# EAGLE schematic SLB_EXT_EAGLE (EAGLE 9.6.2), part 1 of 2

## Sheet 1 of 14
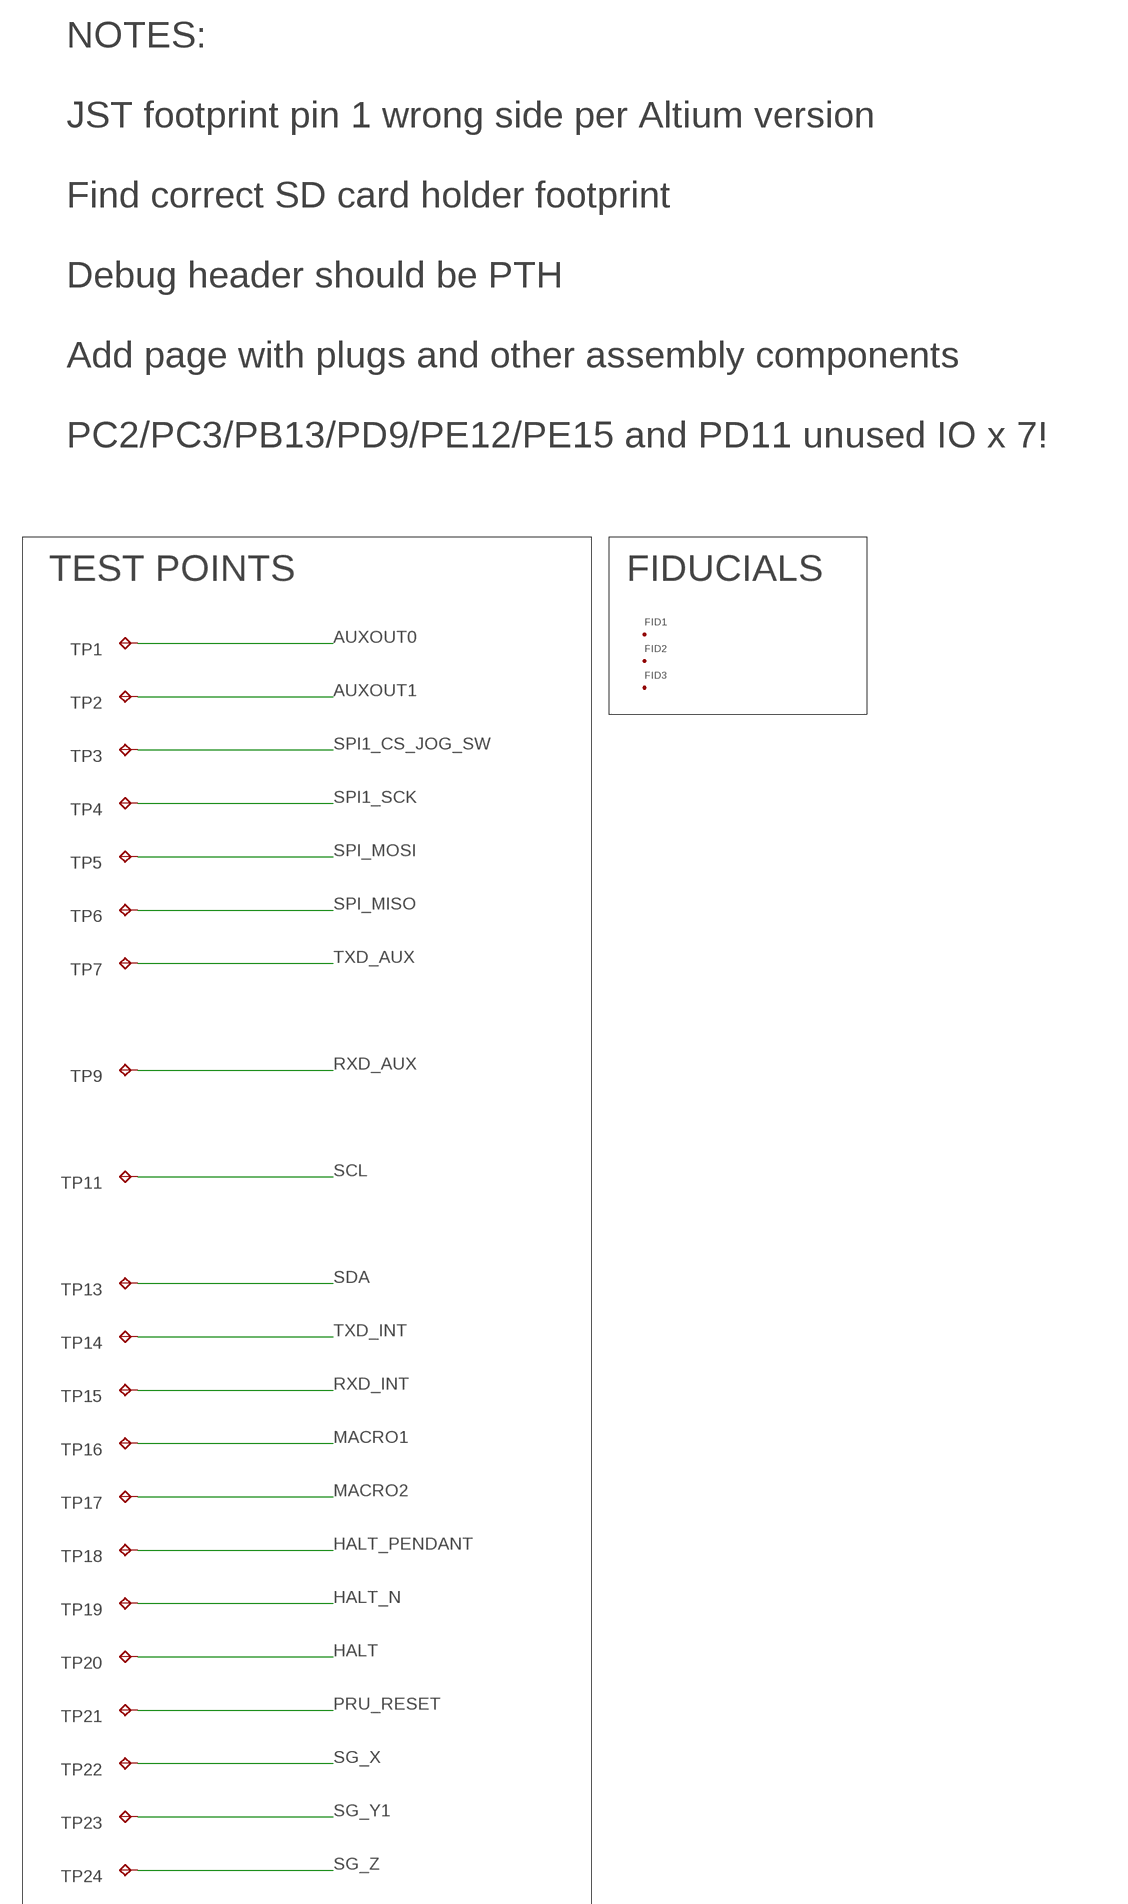
[diagram p0: schematic, sheet 1, part 1 of 2]
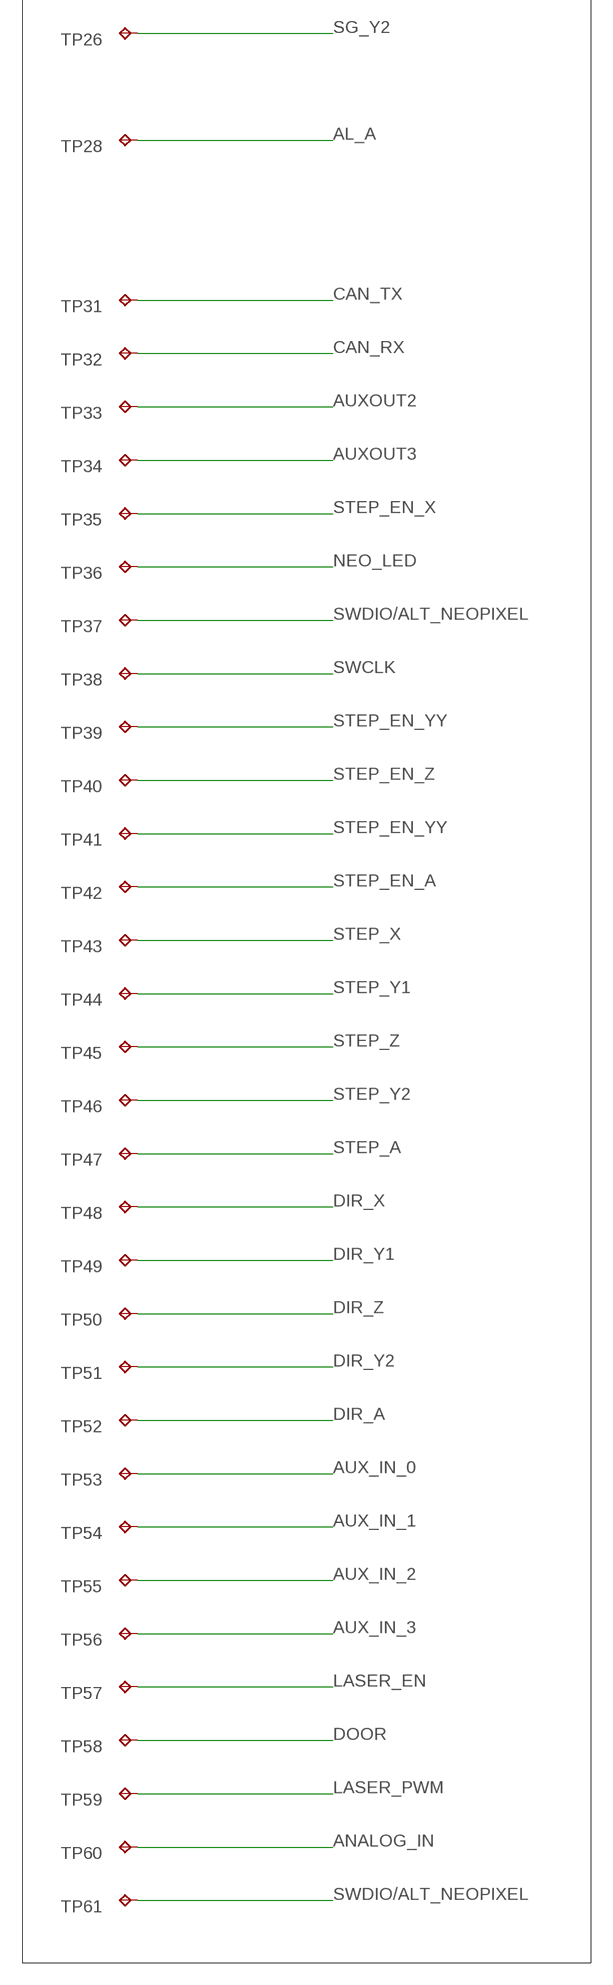
[diagram p1: schematic, sheet 1, part 2 of 2]

### Parts
FID1  FID_40MIL_P  [FID_040_P]
FID2  FID_40MIL_P  [FID_040_P]
FID3  FID_40MIL_P  [FID_040_P]
TP1  TPB2,54  [B2,54]
TP2  TPB2,54  [B2,54]
TP3  TPB2,54  [B2,54]
TP4  TPB2,54  [B2,54]
TP5  TPB2,54  [B2,54]
TP6  TPB2,54  [B2,54]
TP7  TPB2,54  [B2,54]
TP9  TPB2,54  [B2,54]
TP11  TPB2,54  [B2,54]
TP13  TPB2,54  [B2,54]
TP14  TPB2,54  [B2,54]
TP15  TPB2,54  [B2,54]
TP16  TPB2,54  [B2,54]
TP17  TPB2,54  [B2,54]
TP18  TPB2,54  [B2,54]
TP19  TPB2,54  [B2,54]
TP20  TPB2,54  [B2,54]
TP21  TPB2,54  [B2,54]
TP22  TPB2,54  [B2,54]
TP23  TPB2,54  [B2,54]
TP24  TPB2,54  [B2,54]
TP26  TPB2,54  [B2,54]
TP28  TPB2,54  [B2,54]
TP31  TPB2,54  [B2,54]
TP32  TPB2,54  [B2,54]
TP33  TPB2,54  [B2,54]
TP34  TPB2,54  [B2,54]
TP35  TPB2,54  [B2,54]
TP36  TPB2,54  [B2,54]
TP37  TPB2,54  [B2,54]
TP38  TPB2,54  [B2,54]
TP39  TPB2,54  [B2,54]
TP40  TPB2,54  [B2,54]
TP41  TPB2,54  [B2,54]
TP42  TPB2,54  [B2,54]
TP43  TPB2,54  [B2,54]
TP44  TPB2,54  [B2,54]
TP45  TPB2,54  [B2,54]
TP46  TPB2,54  [B2,54]
TP47  TPB2,54  [B2,54]
TP48  TPB2,54  [B2,54]
TP49  TPB2,54  [B2,54]
TP50  TPB2,54  [B2,54]
TP51  TPB2,54  [B2,54]
TP52  TPB2,54  [B2,54]
TP53  TPB2,54  [B2,54]
TP54  TPB2,54  [B2,54]
TP55  TPB2,54  [B2,54]
TP56  TPB2,54  [B2,54]
TP57  TPB2,54  [B2,54]
TP58  TPB2,54  [B2,54]
TP59  TPB2,54  [B2,54]
TP60  TPB2,54  [B2,54]
TP61  TPB2,54  [B2,54]

### Nets
AL_A: TP28.TP ; also sheet 3,6
ANALOG_IN: TP60.TP ; also sheet 3,6
AUX_IN_0: TP53.TP ; also sheet 3,6
AUX_IN_1: TP54.TP ; also sheet 3,6
AUX_IN_2: TP55.TP ; also sheet 3,6
AUX_IN_3: TP56.TP ; also sheet 3,6
AUXOUT0: TP1.TP ; also sheet 3,6
AUXOUT1: TP2.TP ; also sheet 3,6
AUXOUT2: TP33.TP ; also sheet 3,6
AUXOUT3: TP34.TP ; also sheet 3,6
CAN_RX: TP32.TP ; also sheet 3,12
CAN_TX: TP31.TP ; also sheet 3,12
DIR_A: TP52.TP ; also sheet 3,6
DIR_X: TP48.TP ; also sheet 3,5
DIR_Y1: TP49.TP ; also sheet 3,5
DIR_Y2: TP51.TP ; also sheet 3,5
DIR_Z: TP50.TP ; also sheet 3,5
DOOR: TP58.TP ; also sheet 3,8
HALT: TP20.TP ; also sheet 2
HALT_N: TP19.TP ; also sheet 2,3,6,7
HALT_PENDANT: TP18.TP ; also sheet 2,12
LASER_EN: TP57.TP ; also sheet 3,11
LASER_PWM: TP59.TP ; also sheet 3,11
MACRO1: TP16.TP ; also sheet 3,7
MACRO2: TP17.TP ; also sheet 3,7
NEO_LED: TP36.TP ; also sheet 3,6
PRU_RESET: TP21.TP ; also sheet 3,4
RXD_AUX: TP9.TP ; also sheet 3,6
RXD_INT: TP15.TP ; also sheet 3
SCL: TP11.TP ; also sheet 3,6
SDA: TP13.TP ; also sheet 3,6
SG_X: TP22.TP ; also sheet 3,5
SG_Y1: TP23.TP ; also sheet 3,5
SG_Y2: TP26.TP ; also sheet 3,5
SG_Z: TP24.TP ; also sheet 3,5
SPI1_CS_JOG_SW: TP3.TP ; also sheet 3,4
SPI1_SCK: TP4.TP ; also sheet 3
SPI_MISO: TP6.TP ; also sheet 3
SPI_MOSI: TP5.TP ; also sheet 3
STEP_A: TP47.TP ; also sheet 3,6
STEP_EN_A: TP42.TP ; also sheet 3,6
STEP_EN_X: TP35.TP ; also sheet 3,5
STEP_EN_YY: TP39.TP TP41.TP ; also sheet 3,5
STEP_EN_Z: TP40.TP ; also sheet 3,5
STEP_X: TP43.TP ; also sheet 3,5
STEP_Y1: TP44.TP ; also sheet 3,5
STEP_Y2: TP46.TP ; also sheet 3,5
STEP_Z: TP45.TP ; also sheet 3,5
SWCLK: TP38.TP ; also sheet 3,4
SWDIO/ALT_NEOPIXEL: TP37.TP TP61.TP ; also sheet 3,4,6
TXD_AUX: TP7.TP ; also sheet 3,6
TXD_INT: TP14.TP ; also sheet 3

### Notes on the sheet
- NOTES:
  
  JST footprint pin 1 wrong side per Altium version
  
  Find correct SD card holder footprint
  
  Debug header should be PTH
  
  Add page with plugs and other assembly components
  
  PC2/PC3/PB13/PD9/PE12/PE15 and PD11 unused IO x 7!
- TEST POINTS | FIDUCIALS

## Sheet 2 of 14: Equiv to Page 4/27 of Longboard_32bit_ext_Schematic_B9_FULL_PLACE.PDF
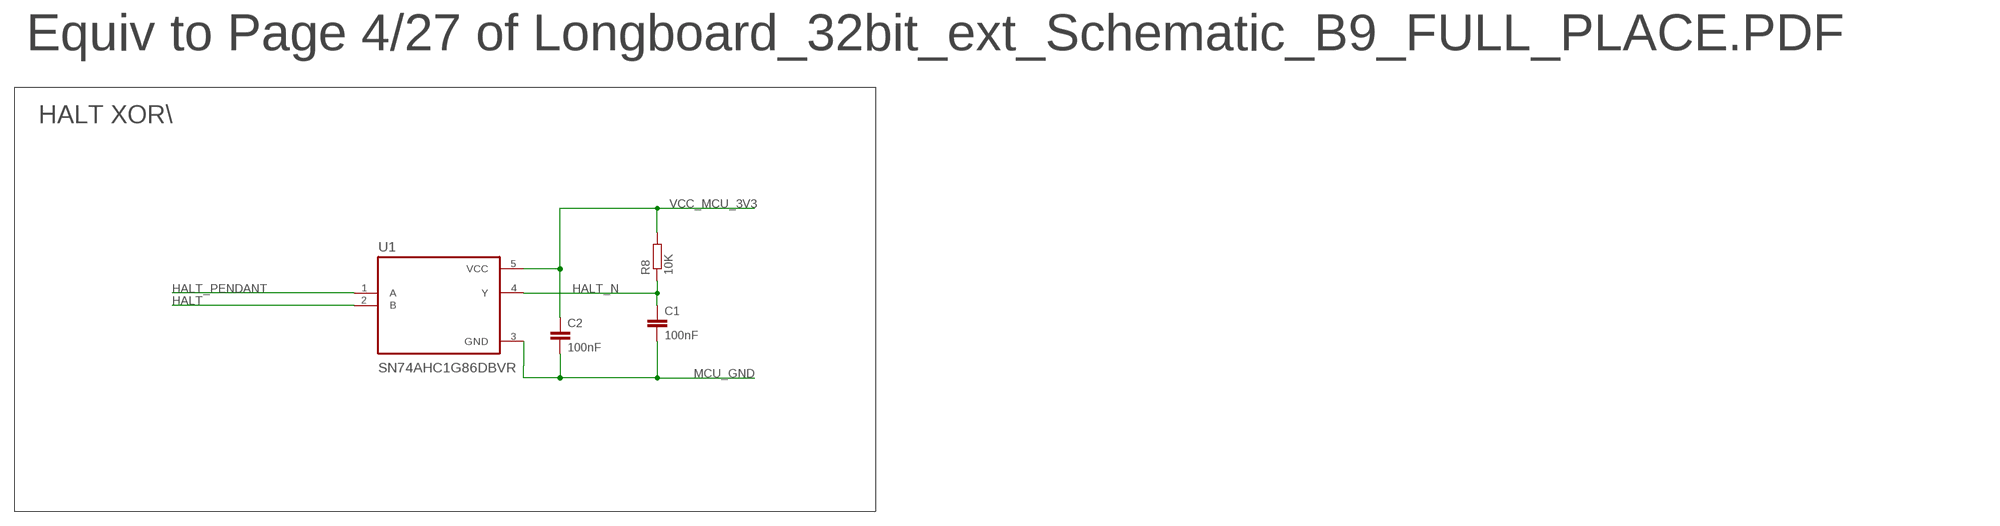
[diagram p2: schematic, sheet 2]

### Parts
C1  100nF  C-EUC0402  [C0402]
C2  100nF  C-EUC0402  [C0402]
R8  10K  R-EU_R0402  [R0402]
U1  SN74AHC1G86DBVR  [SOT95P280X145-5N]

### Nets
HALT: U1.2(B) ; also sheet 1
HALT_N: C1.1 R8.1 U1.4(Y) ; also sheet 1,3,6,7
HALT_PENDANT: U1.1(A) ; also sheet 1,12
MCU_GND: C1.2 C2.2 U1.3(GND) ; also sheet 3,5,6,9,11,12,13,14
VCC_MCU_3V3: C2.1 R8.2 U1.5(VCC) ; also sheet 3,4,5,6,7,8,9,11,12,14

### Notes on the sheet
- Equiv to Page 4/27 of Longboard_32bit_ext_Schematic_B9_FULL_PLACE.PDF
- HALT XOR\

## Sheet 3 of 14: Equiv to Page 5/27 of Longboard_32bit_ext_Schematic_B9_FULL_PLACE.PDF
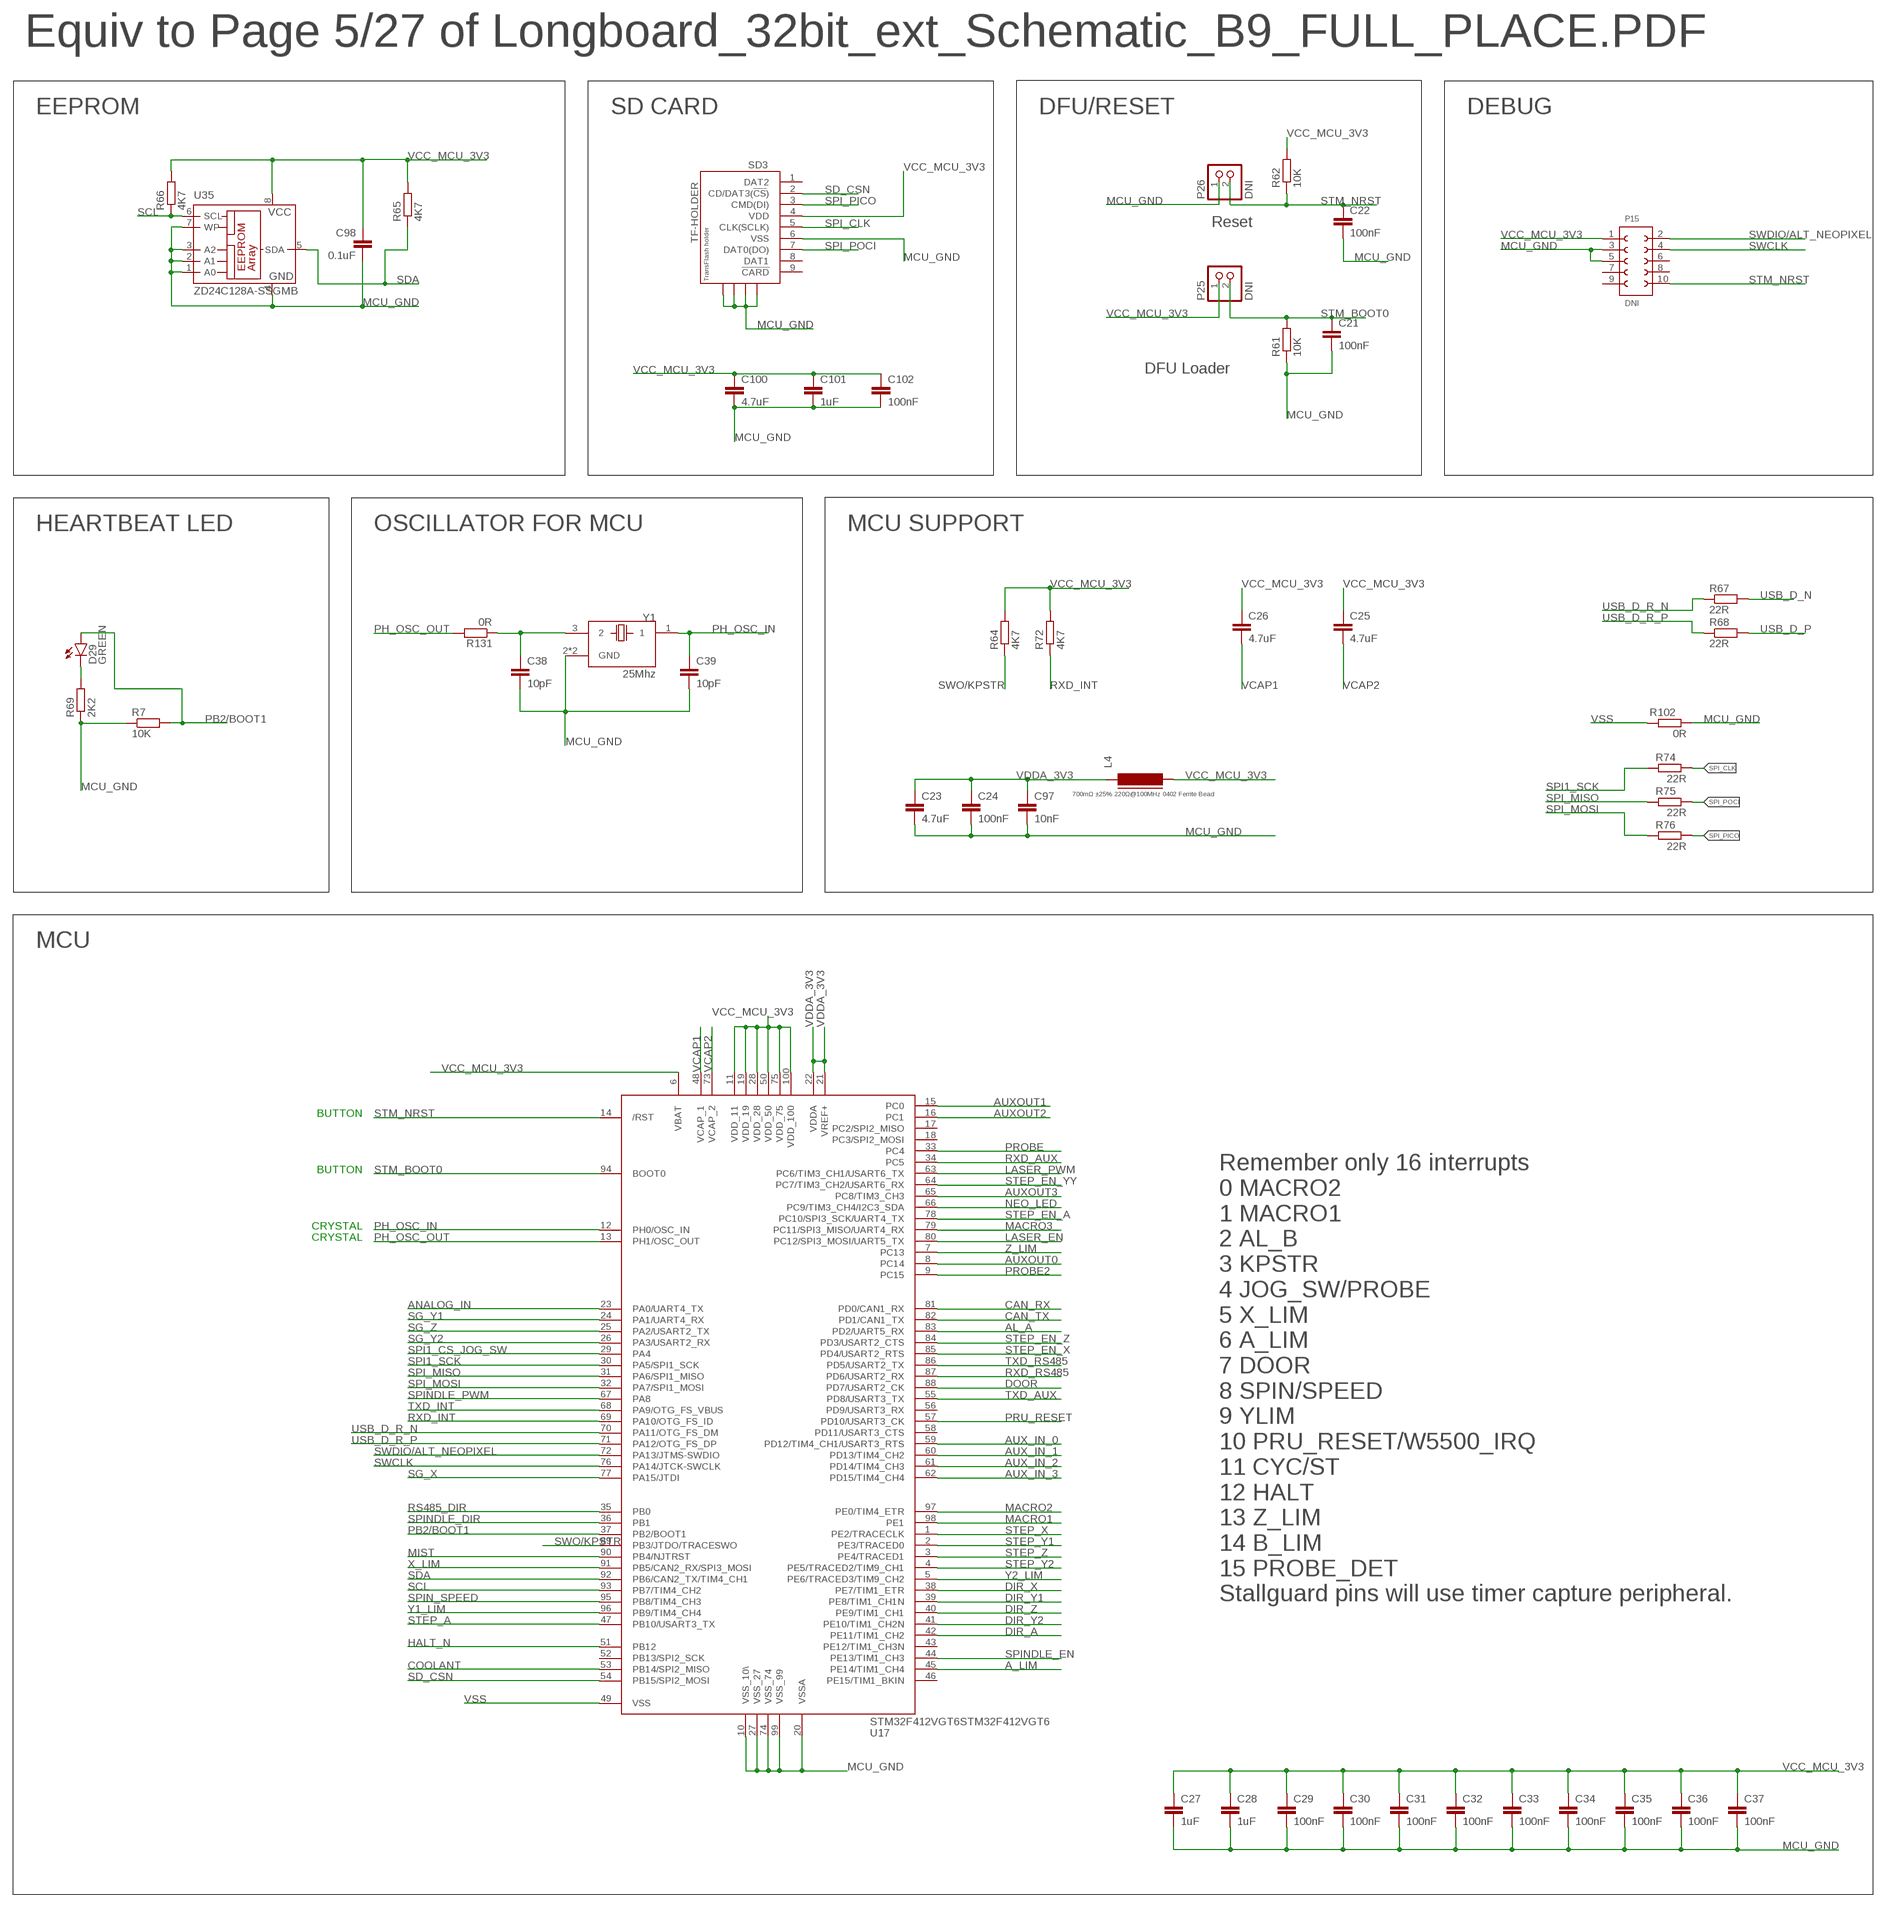
[diagram p3: schematic, sheet 3]

### Parts
C21  100nF  C-EUC0402  [C0402]
C22  100nF  C-EUC0402  [C0402]
C23  4.7uF  C-EUC0603K  [C0603K]
C24  100nF  C-EUC0402  [C0402]
C25  4.7uF  C-EUC0603K  [C0603K]
C26  4.7uF  C-EUC0603K  [C0603K]
C27  1uF  C-EUC0603  [C0603]
C28  1uF  C-EUC0603K  [C0603K]
C29  100nF  C-EUC0402  [C0402]
C30  100nF  C-EUC0402  [C0402]
C31  100nF  C-EUC0402  [C0402]
C32  100nF  C-EUC0402  [C0402]
C33  100nF  C-EUC0402  [C0402]
C34  100nF  C-EUC0402  [C0402]
C35  100nF  C-EUC0402  [C0402]
C36  100nF  C-EUC0402  [C0402]
C37  100nF  C-EUC0402  [C0402]
C38  10pF  C-EUC0603K  [C0603K]
C39  10pF  C-EUC0603K  [C0603K]
C97  10nF  C-EUC0402  [C0402]
C98  0.1uF  CAP0805  [0805]
C100  4.7uF  C-EUC0603K  [C0603K]
C101  1uF  C-EUC0402  [C0402]
C102  100nF  C-EUC0402  [C0402]
D29  GREEN  LEDCHIP-LED0603  [CHIP-LED0603]
L4  700mΩ ±25% 220Ω@100MHz 0402 Ferrite Bead  FERRITE-0402  [FB402]
P15  DNI  621X1021021  [621X1021021]
P25  DNI  PINHD-1X2  [1X02]
P26  DNI  PINHD-1X2  [1X02]
R7  10K  R-EU_R0402  [R0402]
R61  10K  R-EU_R0402  [R0402]
R62  10K  R-EU_R0402  [R0402]
R64  4K7  R-EU_R0402  [R0402]
R65  4K7  R-EU_R0402  [R0402]
R66  4K7  R-EU_R0402  [R0402]
R67  22R  R-EU_R0603  [R0603]
R68  22R  R-EU_R0603  [R0603]
R69  2K2  R-EU_R0402  [R0402]
R72  4K7  R-EU_R0402  [R0402]
R74  22R  R-EU_R0603  [R0603]
R75  22R  R-EU_R0603  [R0603]
R76  22R  R-EU_R0603  [R0603]
R102  0R  R-EU_R0603  [R0603]
R131  0R  R-EU_R0603  [R0603]
SD3  TF-HOLDER  [TF-PULL]
U17  STM32F412VGT6STM32F412VGT6  [LQFP100]
U35  ZD24C128A-SSGMB  24C64SM  [SO-08M]
Y1  25Mhz  TSX-3225_16.0000MF18X-AC3  [XTAL_TSX-3225_16.0000MF18X-AC3]

### Nets
A_LIM: U17.45(PE14/TIM1_CH4) ; also sheet 8
AL_A: U17.83(PD2/UART5_RX) ; also sheet 1,6
ANALOG_IN: U17.23(PA0/UART4_TX) ; also sheet 1,6
AUX_IN_0: U17.59(PD12/TIM4_CH1/USART3_RTS) ; also sheet 1,6
AUX_IN_1: U17.60(PD13/TIM4_CH2) ; also sheet 1,6
AUX_IN_2: U17.61(PD14/TIM4_CH3) ; also sheet 1,6
AUX_IN_3: U17.62(PD15/TIM4_CH4) ; also sheet 1,6
AUXOUT0: U17.8(PC14) ; also sheet 1,6
AUXOUT1: U17.15(PC0) ; also sheet 1,6
AUXOUT2: U17.16(PC1) ; also sheet 1,6
AUXOUT3: U17.65(PC8/TIM3_CH3) ; also sheet 1,6
CAN_RX: U17.81(PD0/CAN1_RX) ; also sheet 1,12
CAN_TX: U17.82(PD1/CAN1_TX) ; also sheet 1,12
COOLANT: U17.53(PB14/SPI2_MISO) ; also sheet 6
DIR_A: U17.42(PE11/TIM1_CH2) ; also sheet 1,6
DIR_X: U17.38(PE7/TIM1_ETR) ; also sheet 1,5
DIR_Y1: U17.39(PE8/TIM1_CH1N) ; also sheet 1,5
DIR_Y2: U17.41(PE10/TIM1_CH2N) ; also sheet 1,5
DIR_Z: U17.40(PE9/TIM1_CH1) ; also sheet 1,5
DOOR: U17.88(PD7/USART2_CK) ; also sheet 1,8
HALT_N: U17.51(PB12) ; also sheet 1,2,6,7
LASER_EN: U17.80(PC12/SPI3_MOSI/UART5_TX) ; also sheet 1,11
LASER_PWM: U17.63(PC6/TIM3_CH1/USART6_TX) ; also sheet 1,11
MACRO1: U17.98(PE1) ; also sheet 1,7
MACRO2: U17.97(PE0/TIM4_ETR) ; also sheet 1,7
MACRO3: U17.79(PC11/SPI3_MISO/UART4_RX) ; also sheet 7
MCU_GND: C21.2 C22.2 C23.2 C24.2 C27.2 C28.2 C29.2 C30.2 C31.2 C32.2 C33.2 C34.2 C35.2 C36.2 C37.2 C38.2 C39.2 C97.2 C98.2 C100.2 C101.2 C102.2 P15.3 P15.5 P26.1 R7.1 R61.1 R69.1 R102.1 SD3.6(VSS) SD3.S1 SD3.S2 SD3.S3 SD3.S4 U17.10(VSS_10\) U17.20(VSSA) U17.27(VSS_27) U17.74(VSS_74) U17.99(VSS_99) U35.1(A0) U35.2(A1) U35.3(A2) U35.4(GND) U35.7(WP) Y1.2(GND) Y1.4(GND) ; also sheet 2,5,6,9,11,12,13,14
MIST: U17.90(PB4/NJTRST) ; also sheet 6
N$2: C38.1 R131.1 Y1.3
N$8: D29.C R69.2
NEO_LED: U17.66(PC9/TIM3_CH4/I2C3_SDA) ; also sheet 1,6
PB2/BOOT1: D29.A R7.2 U17.37(PB2/BOOT1)
PH_OSC_IN: C39.1 U17.12(PH0/OSC_IN) Y1.1
PH_OSC_OUT: R131.2 U17.13(PH1/OSC_OUT)
PROBE: U17.33(PC4) ; also sheet 8
PROBE2: U17.9(PC15) ; also sheet 8
PRU_RESET: U17.57(PD10/USART3_CK) ; also sheet 1,4
RS485_DIR: U17.35(PB0) ; also sheet 14
RXD_AUX: U17.34(PC5) ; also sheet 1,6
RXD_INT: R72.1 U17.69(PA10/OTG_FS_ID) ; also sheet 1
RXD_RS485: U17.87(PD6/USART2_RX) ; also sheet 14
SCL: R66.1 U17.93(PB7/TIM4_CH2) U35.6(SCL) ; also sheet 1,6
SD_CSN: SD3.2(CD/DAT3(!CS!)) U17.54(PB15/SPI2_MOSI)
SDA: R65.1 U17.92(PB6/CAN2_TX/TIM4_CH1) U35.5(SDA) ; also sheet 1,6
SG_X: U17.77(PA15/JTDI) ; also sheet 1,5
SG_Y1: U17.24(PA1/UART4_RX) ; also sheet 1,5
SG_Y2: U17.26(PA3/USART2_RX) ; also sheet 1,5
SG_Z: U17.25(PA2/USART2_TX) ; also sheet 1,5
SPI1_CS_JOG_SW: U17.29(PA4) ; also sheet 1,4
SPI1_SCK: R74.2 U17.30(PA5/SPI1_SCK) ; also sheet 1
SPI_CLK: R74.1 SD3.5(CLK(SCLK)) ; also sheet 4
SPI_MISO: R75.2 U17.31(PA6/SPI1_MISO) ; also sheet 1
SPI_MOSI: R76.2 U17.32(PA7/SPI1_MOSI) ; also sheet 1
SPI_PICO: R76.1 SD3.3(CMD(DI)) ; also sheet 4
SPI_POCI: R75.1 SD3.7(DAT0(DO)) ; also sheet 4
SPIN_SPEED: U17.95(PB8/TIM4_CH3) ; also sheet 11
SPINDLE_DIR: U17.36(PB1) ; also sheet 11
SPINDLE_EN: U17.44(PE13/TIM1_CH3) ; also sheet 11
SPINDLE_PWM: U17.67(PA8) ; also sheet 11
STEP_A: U17.47(PB10/USART3_TX) ; also sheet 1,6
STEP_EN_A: U17.78(PC10/SPI3_SCK/UART4_TX) ; also sheet 1,6
STEP_EN_X: U17.85(PD4/USART2_RTS) ; also sheet 1,5
STEP_EN_YY: U17.64(PC7/TIM3_CH2/USART6_RX) ; also sheet 1,5
STEP_EN_Z: U17.84(PD3/USART2_CTS) ; also sheet 1,5
STEP_X: U17.1(PE2/TRACECLK) ; also sheet 1,5
STEP_Y1: U17.2(PE3/TRACED0) ; also sheet 1,5
STEP_Y2: U17.4(PE5/TRACED2/TIM9_CH1) ; also sheet 1,5
STEP_Z: U17.3(PE4/TRACED1) ; also sheet 1,5
STM_BOOT0: C21.1 P25.2 R61.2 U17.94(BOOT0) ; also sheet 4
STM_NRST: C22.1 P15.10 P26.2 R62.1 U17.14(/RST) ; also sheet 4
SWCLK: P15.4 U17.76(PA14/JTCK-SWCLK) ; also sheet 1,4
SWDIO/ALT_NEOPIXEL: P15.2 U17.72(PA13/JTMS-SWDIO) ; also sheet 1,4,6
SWO/KPSTR: R64.1 U17.89(PB3/JTDO/TRACESWO)
TXD_AUX: U17.55(PD8/USART3_TX) ; also sheet 1,6
TXD_INT: U17.68(PA9/OTG_FS_VBUS) ; also sheet 1
TXD_RS485: U17.86(PD5/USART2_TX) ; also sheet 14
USB_D_N: R67.2 ; also sheet 13
USB_D_P: R68.2 ; also sheet 13
USB_D_R_N: R67.1 U17.70(PA11/OTG_FS_DM)
USB_D_R_P: R68.1 U17.71(PA12/OTG_FS_DP)
VCAP1: C26.2 U17.48(VCAP_1)
VCAP2: C25.2 U17.73(VCAP_2)
VCC_MCU_3V3: C25.1 C26.1 C27.1 C28.1 C29.1 C30.1 C31.1 C32.1 C33.1 C34.1 C35.1 C36.1 C37.1 C98.1 C100.1 C101.1 C102.1 L4.2 P15.1 P25.1 R62.2 R64.2 R65.2 R66.2 R72.2 SD3.4(VDD) U17.6(VBAT) U17.11(VDD_11) U17.19(VDD_19) U17.28(VDD_28) U17.50(VDD_50) U17.75(VDD_75) U17.100(VDD_100) U35.8(VCC) ; also sheet 2,4,5,6,7,8,9,11,12,14
VDDA_3V3: C23.1 C24.1 C97.1 L4.1 U17.21(VREF+) U17.22(VDDA)
VSS: R102.2 U17.49(VSS)
X_LIM: U17.91(PB5/CAN2_RX/SPI3_MOSI) ; also sheet 8
Y1_LIM: U17.96(PB9/TIM4_CH4) ; also sheet 8
Y2_LIM: U17.5(PE6/TRACED3/TIM9_CH2) ; also sheet 8
Z_LIM: U17.7(PC13) ; also sheet 8
Unconnected: P15.6 P15.7 P15.8 P15.9 SD3.1(DAT2) SD3.8(DAT1) SD3.9(!CARD) U17.17(PC2/SPI2_MISO) U17.18(PC3/SPI2_MOSI) U17.43(PE12/TIM1_CH3N) U17.46(PE15/TIM1_BKIN) U17.52(PB13/SPI2_SCK) U17.56(PD9/USART3_RX) U17.58(PD11/USART3_CTS)

### Notes on the sheet
- Equiv to Page 5/27 of Longboard_32bit_ext_Schematic_B9_FULL_PLACE.PDF
- EEPROM | SD CARD | DFU/RESET | DEBUG
- Reset
- DFU Loader
- HEARTBEAT LED | OSCILLATOR FOR MCU | MCU SUPPORT
- MCU
- BUTTON
- BUTTON
- CRYSTAL
- CRYSTAL
- Remember only 16 interrupts 
  0 MACRO2 
  1 MACRO1 
  2 AL_B 
  3 KPSTR 
  4 JOG_SW/PROBE 
  5 X_LIM 
  6 A_LIM 
  7 DOOR 
  8 SPIN/SPEED 
  9 YLIM 
  10 PRU_RESET/W5500_IRQ 
  11 CYC/ST 
  12 HALT 
  13 Z_LIM 
  14 B_LIM 
  15 PROBE_DET 
  Stallguard pins will use timer capture peripheral.

## Sheet 4 of 14: Equiv to Page 7/27 of Longboard_32bit_ext_Schematic_B9_FULL_PLACE.PDF
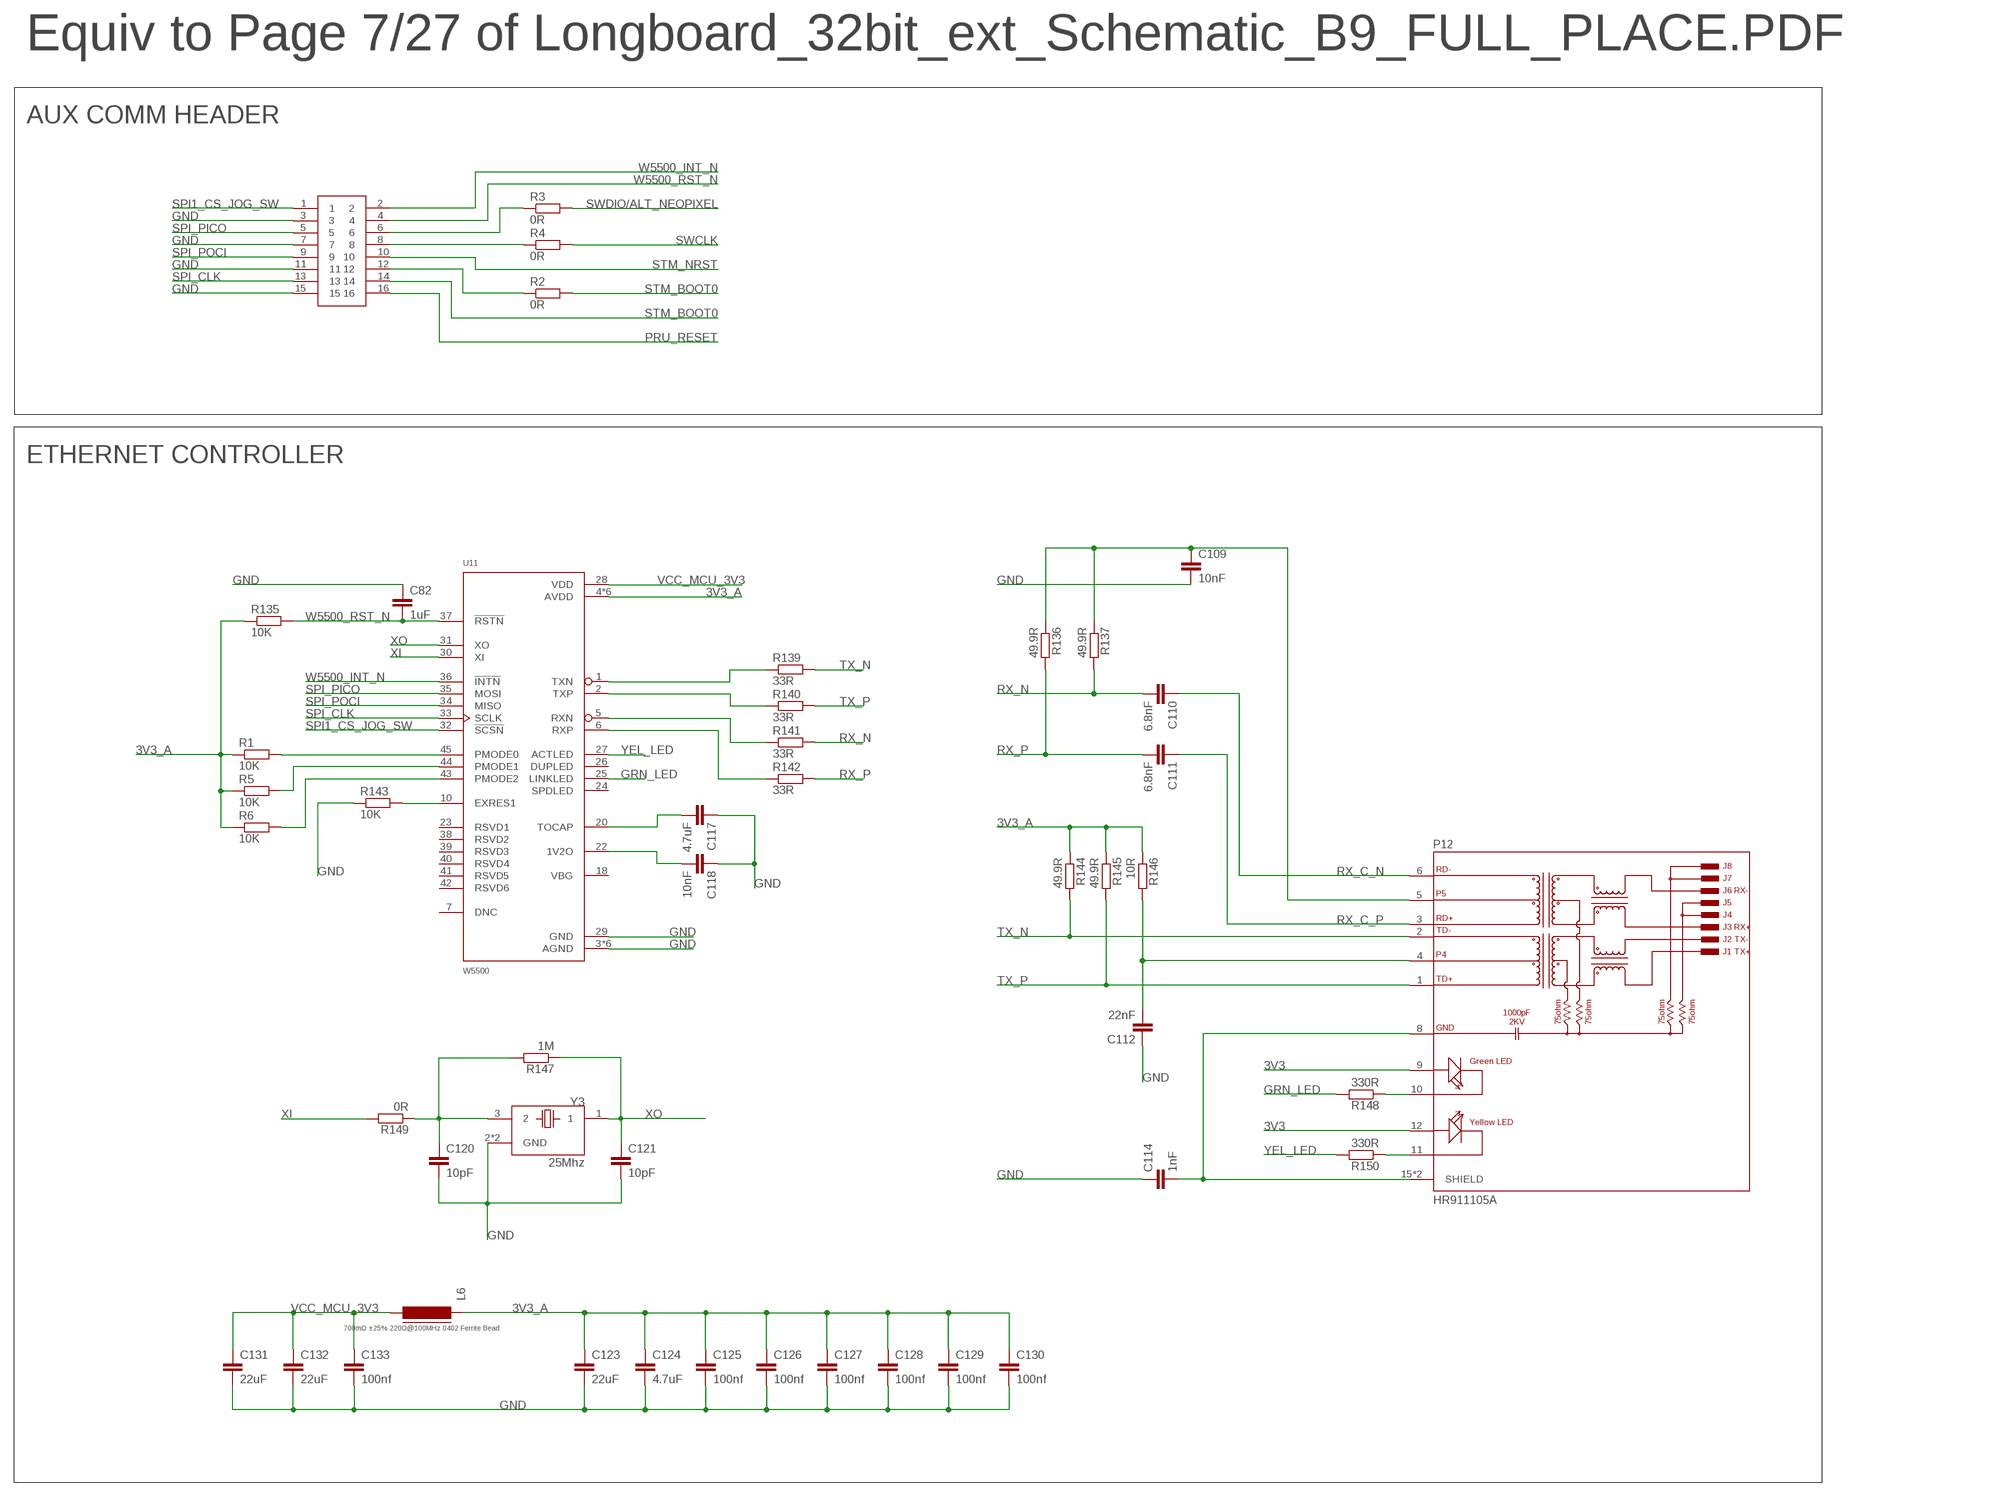
[diagram p4: schematic, sheet 4]

### Parts
C82  1uF  C-EUC0402  [C0402]
C109  10nF  C-EUC0402  [C0402]
C110  6.8nF  C-EUC0402  [C0402]
C111  6.8nF  C-EUC0402  [C0402]
C112  22nF  C-EUC0402  [C0402]
C114  1nF  C-EUC1206  [C1206]
C117  4.7uF  C-EUC0402  [C0402]
C118  10nF  C-EUC0402  [C0402]
C120  10pF  C-EUC0402  [C0402]
C121  10pF  C-EUC0402  [C0402]
C123  22uF  C-EUC0603K  [C0603K]
C124  4.7uF  C-EUC0603K  [C0603K]
C125  100nf  C-EUC0402  [C0402]
C126  100nf  C-EUC0402  [C0402]
C127  100nf  C-EUC0402  [C0402]
C128  100nf  C-EUC0603K  [C0603K]
C129  100nf  C-EUC0402  [C0402]
C130  100nf  C-EUC0402  [C0402]
C131  22uF  C-EUC0603K  [C0603K]
C132  22uF  C-EUC0603K  [C0603K]
C133  100nf  C-EUC0402  [C0402]
J1  16P_HEADER_SMD  [16_PIN_SMD_PIN_HEADER]
L6  700mΩ ±25% 220Ω@100MHz 0402 Ferrite Bead  FERRITE-0402  [FB402]
P12  HR911105A  [HANRUN_HR911105A]
R1  10K  R-EU_R0402  [R0402]
R2  0R  R-EU_R0603  [R0603]
R3  0R  R-EU_R0603  [R0603]
R4  0R  R-EU_R0603  [R0603]
R5  10K  R-EU_R0402  [R0402]
R6  10K  R-EU_R0402  [R0402]
R135  10K  R-EU_R0402  [R0402]
R136  49.9R  R-EU_R0402  [R0402]
R137  49.9R  R-EU_R0402  [R0402]
R139  33R  R-EU_R0402  [R0402]
R140  33R  R-EU_R0402  [R0402]
R141  33R  R-EU_R0402  [R0402]
R142  33R  R-EU_R0402  [R0402]
R143  10K  R-EU_R0603  [R0603]
R144  49.9R  R-EU_R0402  [R0402]
R145  49.9R  R-EU_R0402  [R0402]
R146  10R  R-EU_R0402  [R0402]
R147  1M  R-EU_R0402  [R0402]
R148  330R  R-EU_R0402  [R0402]
R149  0R  R-EU_R0402  [R0402]
R150  330R  R-EU_R0402  [R0402]
U11  W5500  [QFP50P900X900X160-48N]
Y3  25Mhz  TSX-3225_16.0000MF18X-AC3  [XTAL_TSX-3225_16.0000MF18X-AC3]

### Nets
3V3: P12.9(GA) P12.12(YA)
3V3_A: C123.1 C124.1 C125.1 C126.1 C127.1 C128.1 C129.1 C130.1 L6.1 R1.1 R5.1 R6.1 R135.1 R144.1 R145.1 R146.1 U11.4(AVDD) U11.8(AVDD) U11.11(AVDD) U11.15(AVDD) U11.17(AVDD) U11.21(AVDD)
GND: C82.1 C109.2 C112.1 C114.1 C117.1 C118.1 C120.2 C121.2 C123.2 C124.2 C125.2 C126.2 C127.2 C128.2 C129.2 C130.2 C131.2 C132.2 C133.2 J1.3 J1.7 J1.11 J1.15 R143.1 U11.3(AGND) U11.9(AGND) U11.14(AGND) U11.16(AGND) U11.19(AGND) U11.29(GND) U11.48(AGND) Y3.2(GND) Y3.4(GND) ; also sheet 5,6,7,8,9,10,11,12,14
GRN_LED: R148.2 U11.25(LINKLED)
N$22: P12.11(YC) R150.1
N$23: P12.10(GC) R148.1
N$24: C114.2 P12.8(GND) P12.15(SHIELD) P12.16(SHIELD)
N$25: C120.1 R147.2 R149.1 Y3.3
N$26: C112.2 P12.4 R146.2
N$27: R139.1 U11.1(TXN)
N$28: R140.1 U11.2(TXP)
N$29: C109.1 P12.5 R136.1 R137.1
N$30: R141.1 U11.5(RXN)
N$31: R142.1 U11.6(RXP)
N$32: R143.2 U11.10(EXRES1)
N$33: C117.2 U11.20(TOCAP)
N$34: C118.2 U11.22(1V2O)
N$35: R6.2 U11.43(PMODE2)
N$36: R5.2 U11.44(PMODE1)
N$37: R1.2 U11.45(PMODE0)
N$38: J1.6 R3.1
N$39: J1.8 R4.1
N$40: J1.12 R2.1
PRU_RESET: J1.16 ; also sheet 1,3
RX_C_N: C110.1 P12.6(RD-)
RX_C_P: C111.1 P12.3(RD+)
RX_N: C110.2 R137.2 R141.2
RX_P: C111.2 R136.2 R142.2
SPI1_CS_JOG_SW: J1.1 U11.32(!SCSN) ; also sheet 1,3
SPI_CLK: J1.13 U11.33(SCLK) ; also sheet 3
SPI_PICO: J1.5 U11.35(MOSI) ; also sheet 3
SPI_POCI: J1.9 U11.34(MISO) ; also sheet 3
STM_BOOT0: J1.14 R2.2 ; also sheet 3
STM_NRST: J1.10 ; also sheet 3
SWCLK: R4.2 ; also sheet 1,3
SWDIO/ALT_NEOPIXEL: R3.2 ; also sheet 1,3,6
TX_N: P12.2(TD-) R139.2 R144.2
TX_P: P12.1(TD+) R140.2 R145.2
VCC_MCU_3V3: C131.1 C132.1 C133.1 L6.2 U11.28(VDD) ; also sheet 2,3,5,6,7,8,9,11,12,14
W5500_INT_N: J1.2 U11.36(!INTN)
W5500_RST_N: C82.2 J1.4 R135.2 U11.37(!RSTN)
XI: R149.2 U11.30(XI)
XO: C121.1 R147.1 U11.31(XO) Y3.1
YEL_LED: R150.2 U11.27(ACTLED)
Unconnected: U11.7(DNC) U11.18(VBG) U11.23(RSVD1) U11.24(SPDLED) U11.26(DUPLED) U11.38(RSVD2) U11.39(RSVD3) U11.40(RSVD4) U11.41(RSVD5) U11.42(RSVD6)

### Notes on the sheet
- Equiv to Page 7/27 of Longboard_32bit_ext_Schematic_B9_FULL_PLACE.PDF
- AUX COMM HEADER
- ETHERNET CONTROLLER

## Sheet 5 of 14: Equiv to Page 8/27 of Longboard_32bit_ext_Schematic_B9_FULL_PLACE.PDF
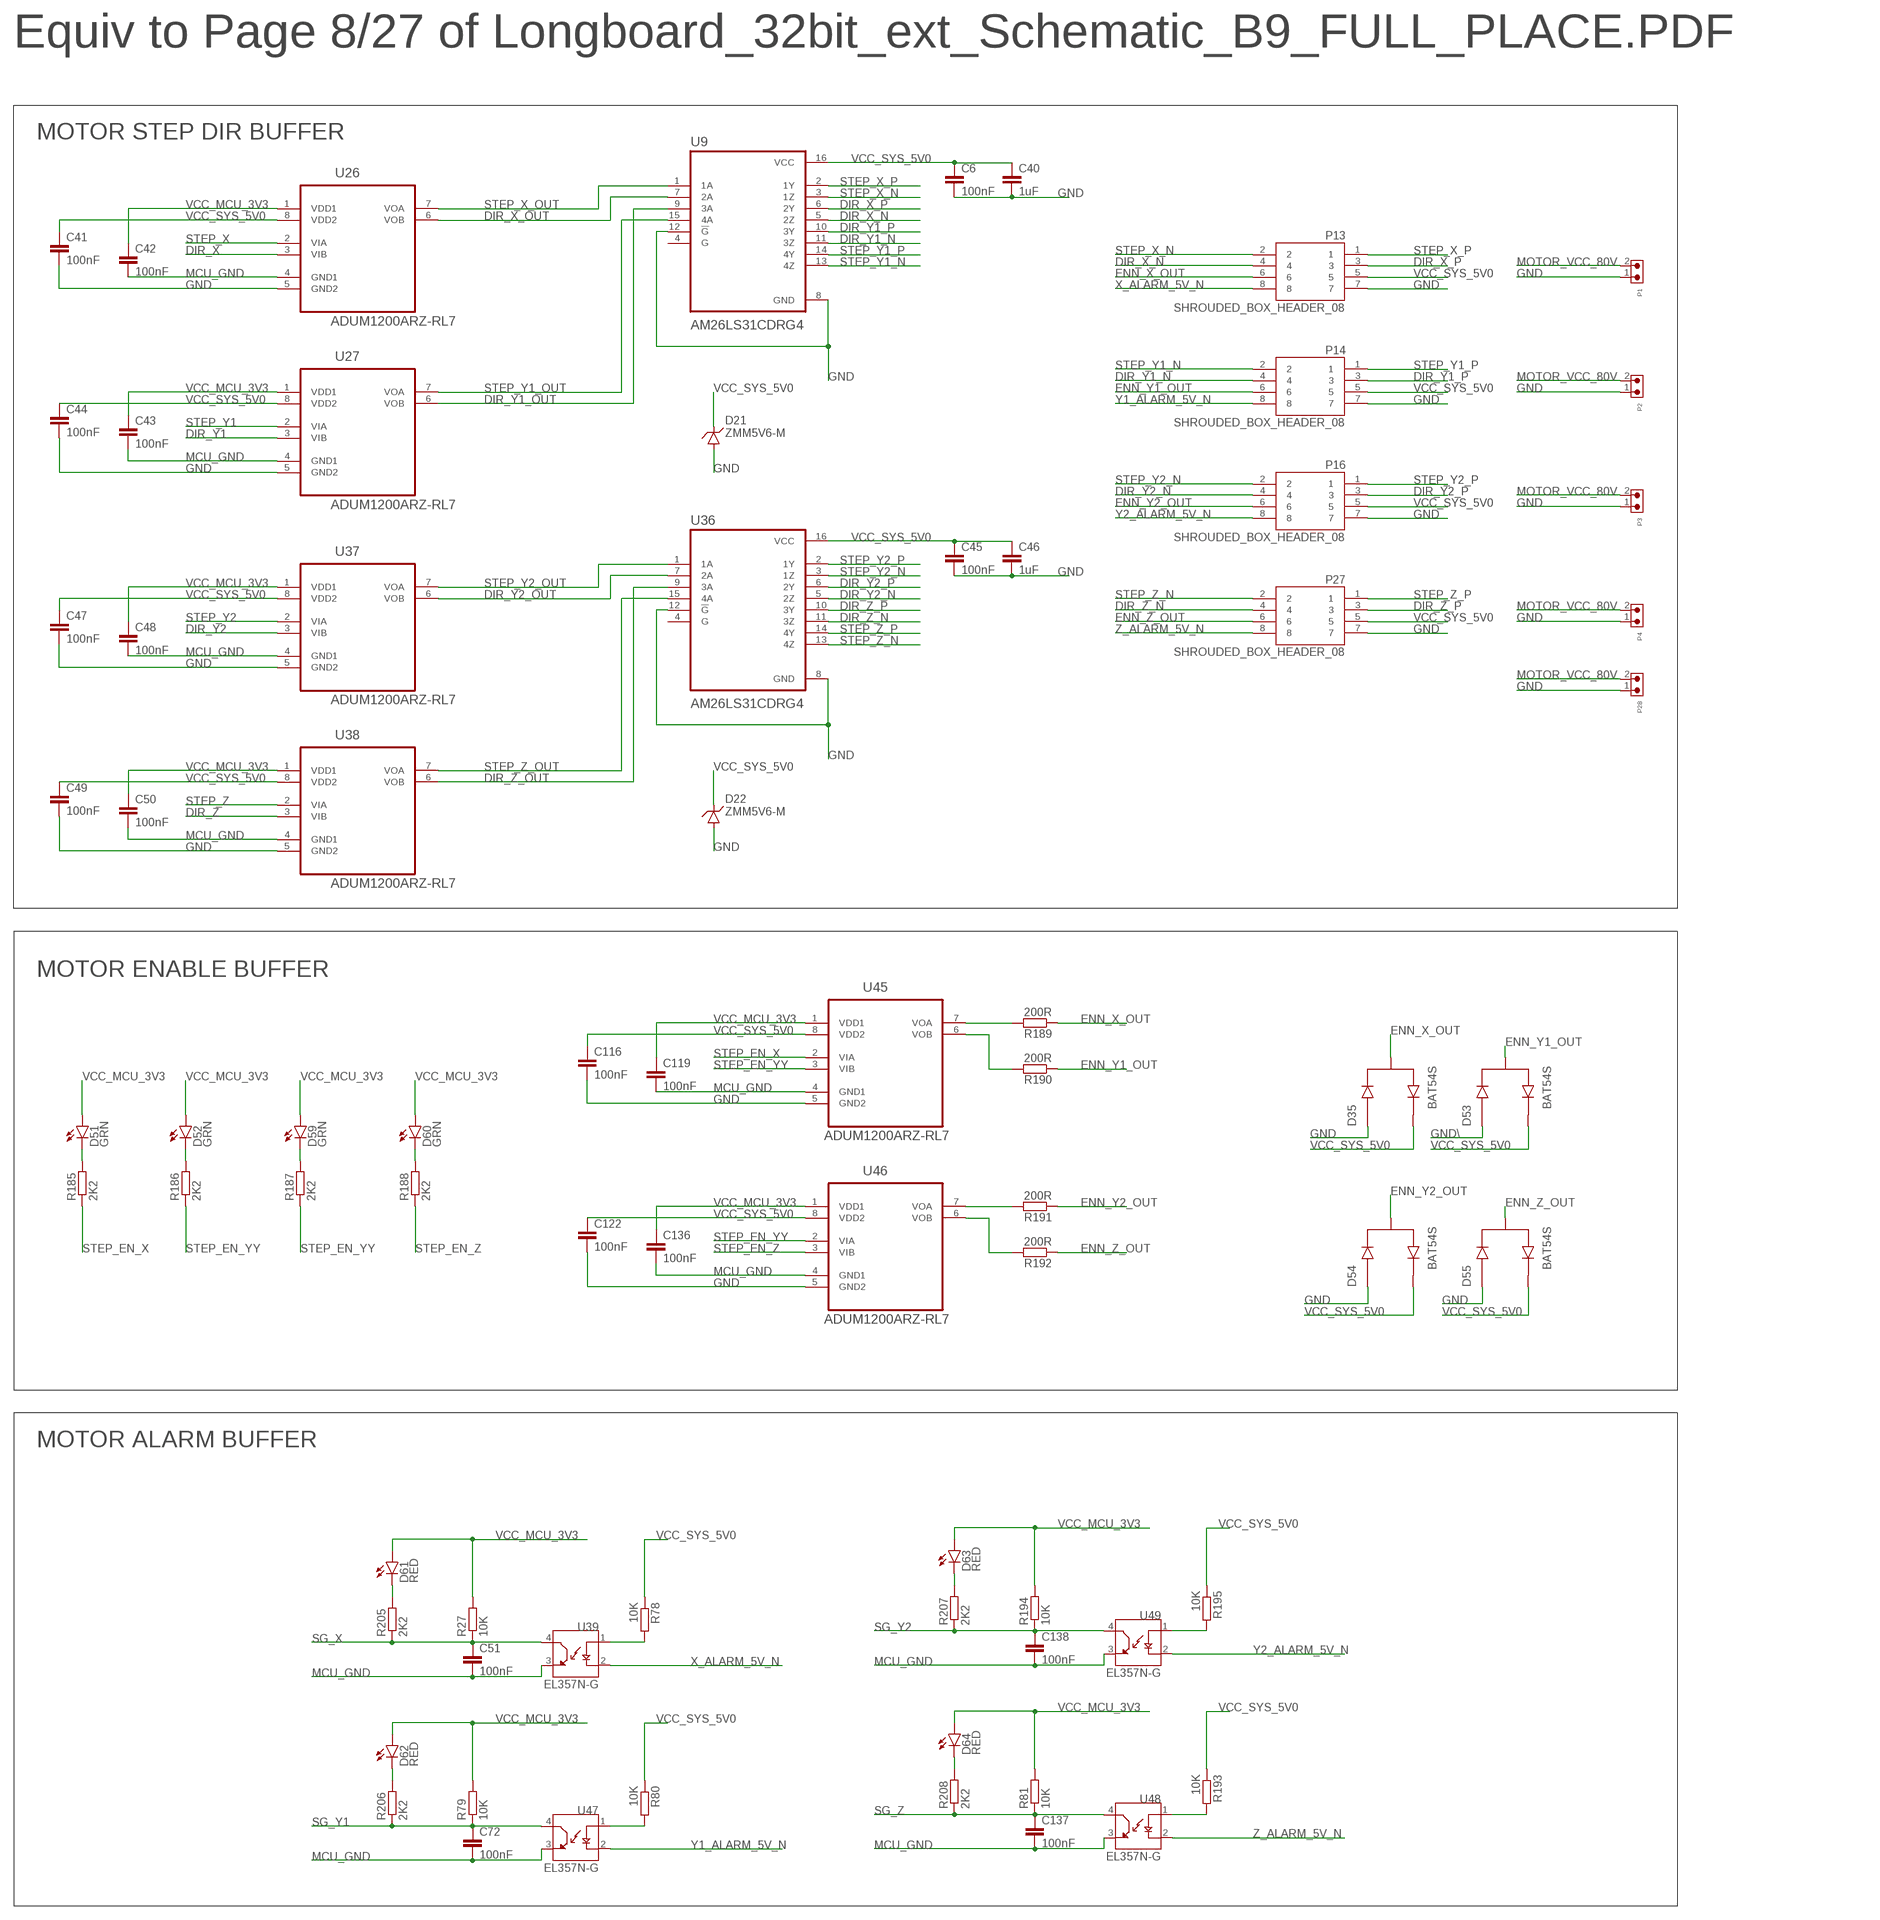
[diagram p5: schematic, sheet 5]

### Parts
C6  100nF  C-EUC0603K  [C0603K]
C40  1uF  C-EUC0603K  [C0603K]
C41  100nF  C-EUC0603K  [C0603K]
C42  100nF  C-EUC0603K  [C0603K]
C43  100nF  C-EUC0603K  [C0603K]
C44  100nF  C-EUC0603K  [C0603K]
C45  100nF  C-EUC0603K  [C0603K]
C46  1uF  C-EUC0603K  [C0603K]
C47  100nF  C-EUC0603K  [C0603K]
C48  100nF  C-EUC0603K  [C0603K]
C49  100nF  C-EUC0603K  [C0603K]
C50  100nF  C-EUC0603K  [C0603K]
C51  100nF  C-EUC0603K  [C0603K]
C72  100nF  C-EUC0402  [C0402]
C116  100nF  C-EUC0603K  [C0603K]
C119  100nF  C-EUC0603K  [C0603K]
C122  100nF  C-EUC0603K  [C0603K]
C136  100nF  C-EUC0603K  [C0603K]
C137  100nF  C-EUC0603K  [C0603K]
C138  100nF  C-EUC0603K  [C0603K]
D21  ZMM5V6-M  DIODE-MINIMELF  [MINIMELF]
D22  ZMM5V6-M  DIODE-MINIMELF  [MINIMELF]
D35  BAT54S  [SOT95P240X120-3N]
D51  GRN  LEDCHIP-LED0603  [CHIP-LED0603]
D52  GRN  LEDCHIP-LED0603  [CHIP-LED0603]
D53  BAT54S  [SOT95P240X120-3N]
D54  BAT54S  [SOT95P240X120-3N]
D55  BAT54S  [SOT95P240X120-3N]
D59  GRN  LEDCHIP-LED0603  [CHIP-LED0603]
D60  GRN  LEDCHIP-LED0603  [CHIP-LED0603]
D61  RED  LEDCHIP-LED0603  [CHIP-LED0603]
D62  RED  LEDCHIP-LED0603  [CHIP-LED0603]
D63  RED  LEDCHIP-LED0603  [CHIP-LED0603]
D64  RED  LEDCHIP-LED0603  [CHIP-LED0603]
P1  DB2EVC-3.81-2P-GN  [DB2EVC-3.81-2P-GN]
P2  DB2EVC-3.81-2P-GN  [DB2EVC-3.81-2P-GN]
P3  DB2EVC-3.81-2P-GN  [DB2EVC-3.81-2P-GN]
P4  DB2EVC-3.81-2P-GN  [DB2EVC-3.81-2P-GN]
P13  SHROUDED_BOX_HEADER_08  [SHROUDED_BOX_HEADER_08]
P14  SHROUDED_BOX_HEADER_08  [SHROUDED_BOX_HEADER_08]
P16  SHROUDED_BOX_HEADER_08  [SHROUDED_BOX_HEADER_08]
P27  SHROUDED_BOX_HEADER_08  [SHROUDED_BOX_HEADER_08]
P28  DB2EVC-3.81-2P-GN  [DB2EVC-3.81-2P-GN]
R27  10K  R-EU_R0402  [R0402]
R78  10K  R-EU_R0603  [R0603]
R79  10K  R-EU_R0402  [R0402]
R80  10K  R-EU_R0603  [R0603]
R81  10K  R-EU_R0402  [R0402]
R185  2K2  R-EU_R0402  [R0402]
R186  2K2  R-EU_R0402  [R0402]
R187  2K2  R-EU_R0402  [R0402]
R188  2K2  R-EU_R0402  [R0402]
R189  200R  R-EU_R0603  [R0603]
R190  200R  R-EU_R0603  [R0603]
R191  200R  R-EU_R0603  [R0603]
R192  200R  R-EU_R0603  [R0603]
R193  10K  R-EU_R0603  [R0603]
R194  10K  R-EU_R0402  [R0402]
R195  10K  R-EU_R0603  [R0603]
R205  2K2  R-EU_R0402  [R0402]
R206  2K2  R-EU_R0402  [R0402]
R207  2K2  R-EU_R0402  [R0402]
R208  2K2  R-EU_R0402  [R0402]
U9  AM26LS31CDRG4  AM26LS31CDR  [SOIC127P600X175-16N]
U26  ADUM1200ARZ-RL7  [SOIC127P600X175-8N]
U27  ADUM1200ARZ-RL7  [SOIC127P600X175-8N]
U36  AM26LS31CDRG4  AM26LS31CDR  [SOIC127P600X175-16N]
U37  ADUM1200ARZ-RL7  [SOIC127P600X175-8N]
U38  ADUM1200ARZ-RL7  [SOIC127P600X175-8N]
U39  EL357N-G  [OPTO_EL357N-G]
U45  ADUM1200ARZ-RL7  [SOIC127P600X175-8N]
U46  ADUM1200ARZ-RL7  [SOIC127P600X175-8N]
U47  EL357N-G  [OPTO_EL357N-G]
U48  EL357N-G  [OPTO_EL357N-G]
U49  EL357N-G  [OPTO_EL357N-G]

### Nets
DIR_X: U26.3(VIB) ; also sheet 1,3
DIR_X_N: P13.4 U9.5(2Z)
DIR_X_OUT: U9.7(2A) U26.6(VOB)
DIR_X_P: P13.3 U9.6(2Y)
DIR_Y1: U27.3(VIB) ; also sheet 1,3
DIR_Y1_N: P14.4 U9.11(3Z)
DIR_Y1_OUT: U9.9(3A) U27.6(VOB)
DIR_Y1_P: P14.3 U9.10(3Y)
DIR_Y2: U37.3(VIB) ; also sheet 1,3
DIR_Y2_N: P16.4 U36.5(2Z)
DIR_Y2_OUT: U36.7(2A) U37.6(VOB)
DIR_Y2_P: P16.3 U36.6(2Y)
DIR_Z: U38.3(VIB) ; also sheet 1,3
DIR_Z_N: P27.4 U36.11(3Z)
DIR_Z_OUT: U36.9(3A) U38.6(VOB)
DIR_Z_P: P27.3 U36.10(3Y)
ENN_X_OUT: D35.3 P13.6 R189.1
ENN_Y1_OUT: D53.3 P14.6 R190.1
ENN_Y2_OUT: D54.3 P16.6 R191.1
ENN_Z_OUT: D55.3 P27.6 R192.1
GND: C6.2 C40.2 C41.2 C44.2 C45.2 C46.2 C47.2 C49.2 C116.2 C122.2 D21.A D22.A D35.1 D54.1 D55.1 P1.1 P2.1 P3.1 P4.1 P13.7 P14.7 P16.7 P27.7 P28.1 U9.8(GND) U9.12(!G) U26.5(GND2) U27.5(GND2) U36.8(GND) U36.12(!G) U37.5(GND2) U38.5(GND2) U45.5(GND2) U46.5(GND2) ; also sheet 4,6,7,8,9,10,11,12,14
GND\: D53.1
MCU_GND: C42.2 C43.2 C48.2 C50.2 C51.2 C72.2 C119.2 C136.2 C137.2 C138.2 U26.4(GND1) U27.4(GND1) U37.4(GND1) U38.4(GND1) U39.3(ET) U45.4(GND1) U46.4(GND1) U47.3(ET) U48.3(ET) U49.3(ET) ; also sheet 2,3,6,9,11,12,13,14
MOTOR_VCC_80V: P1.2 P2.2 P3.2 P4.2 P28.2 ; also sheet 9,10
N$1: R189.2 U45.7(VOA)
N$3: R190.2 U45.6(VOB)
N$4: R191.2 U46.7(VOA)
N$6: R192.2 U46.6(VOB)
N$9: R78.2 U39.1(A)
N$10: D62.C R206.2
N$11: D61.C R205.2
N$12: R80.2 U47.1(A)
N$13: D63.C R207.2
N$14: R195.2 U49.1(A)
N$15: D64.C R208.2
N$16: R193.2 U48.1(A)
N$17: D51.C R185.2
N$18: D52.C R186.2
N$20: D59.C R187.2
N$21: D60.C R188.2
SG_X: C51.1 R27.1 R205.1 U39.4(CT) ; also sheet 1,3
SG_Y1: C72.1 R79.1 R206.1 U47.4(CT) ; also sheet 1,3
SG_Y2: C138.1 R194.1 R207.1 U49.4(CT) ; also sheet 1,3
SG_Z: C137.1 R81.1 R208.1 U48.4(CT) ; also sheet 1,3
STEP_EN_X: R185.1 U45.2(VIA) ; also sheet 1,3
STEP_EN_YY: R186.1 R187.1 U45.3(VIB) U46.2(VIA) ; also sheet 1,3
STEP_EN_Z: R188.1 U46.3(VIB) ; also sheet 1,3
STEP_X: U26.2(VIA) ; also sheet 1,3
STEP_X_N: P13.2 U9.3(1Z)
STEP_X_OUT: U9.1(1A) U26.7(VOA)
STEP_X_P: P13.1 U9.2(1Y)
STEP_Y1: U27.2(VIA) ; also sheet 1,3
STEP_Y1_N: P14.2 U9.13(4Z)
STEP_Y1_OUT: U9.15(4A) U27.7(VOA)
STEP_Y1_P: P14.1 U9.14(4Y)
STEP_Y2: U37.2(VIA) ; also sheet 1,3
STEP_Y2_N: P16.2 U36.3(1Z)
STEP_Y2_OUT: U36.1(1A) U37.7(VOA)
STEP_Y2_P: P16.1 U36.2(1Y)
STEP_Z: U38.2(VIA) ; also sheet 1,3
STEP_Z_N: P27.2 U36.13(4Z)
STEP_Z_OUT: U36.15(4A) U38.7(VOA)
STEP_Z_P: P27.1 U36.14(4Y)
VCC_MCU_3V3: C42.1 C43.1 C48.1 C50.1 C119.1 C136.1 D51.A D52.A D59.A D60.A D61.A D62.A D63.A D64.A R27.2 R79.2 R81.2 R194.2 U26.1(VDD1) U27.1(VDD1) U37.1(VDD1) U38.1(VDD1) U45.1(VDD1) U46.1(VDD1) ; also sheet 2,3,4,6,7,8,9,11,12,14
VCC_SYS_5V0: C6.1 C40.1 C41.1 C44.1 C45.1 C46.1 C47.1 C49.1 C116.1 C122.1 D21.C D22.C D35.2 D53.2 D54.2 D55.2 P13.5 P14.5 P16.5 P27.5 R78.1 R80.1 R193.1 R195.1 U9.16(VCC) U26.8(VDD2) U27.8(VDD2) U36.16(VCC) U37.8(VDD2) U38.8(VDD2) U45.8(VDD2) U46.8(VDD2) ; also sheet 6,7,8,9,10,11,14
X_ALARM_5V_N: P13.8 U39.2(C)
Y1_ALARM_5V_N: P14.8 U47.2(C)
Y2_ALARM_5V_N: P16.8 U49.2(C)
Z_ALARM_5V_N: P27.8 U48.2(C)
Unconnected: U9.4(G) U36.4(G)

### Notes on the sheet
- Equiv to Page 8/27 of Longboard_32bit_ext_Schematic_B9_FULL_PLACE.PDF
- MOTOR STEP DIR BUFFER
- MOTOR ENABLE BUFFER
- MOTOR ALARM BUFFER

## Sheet 6 of 14: Equiv to Page 6/9/10/11/12/13/14/15 of 27 of Longboard_32bit_ext_Schematic_B9_FULL_PLACE.PDF
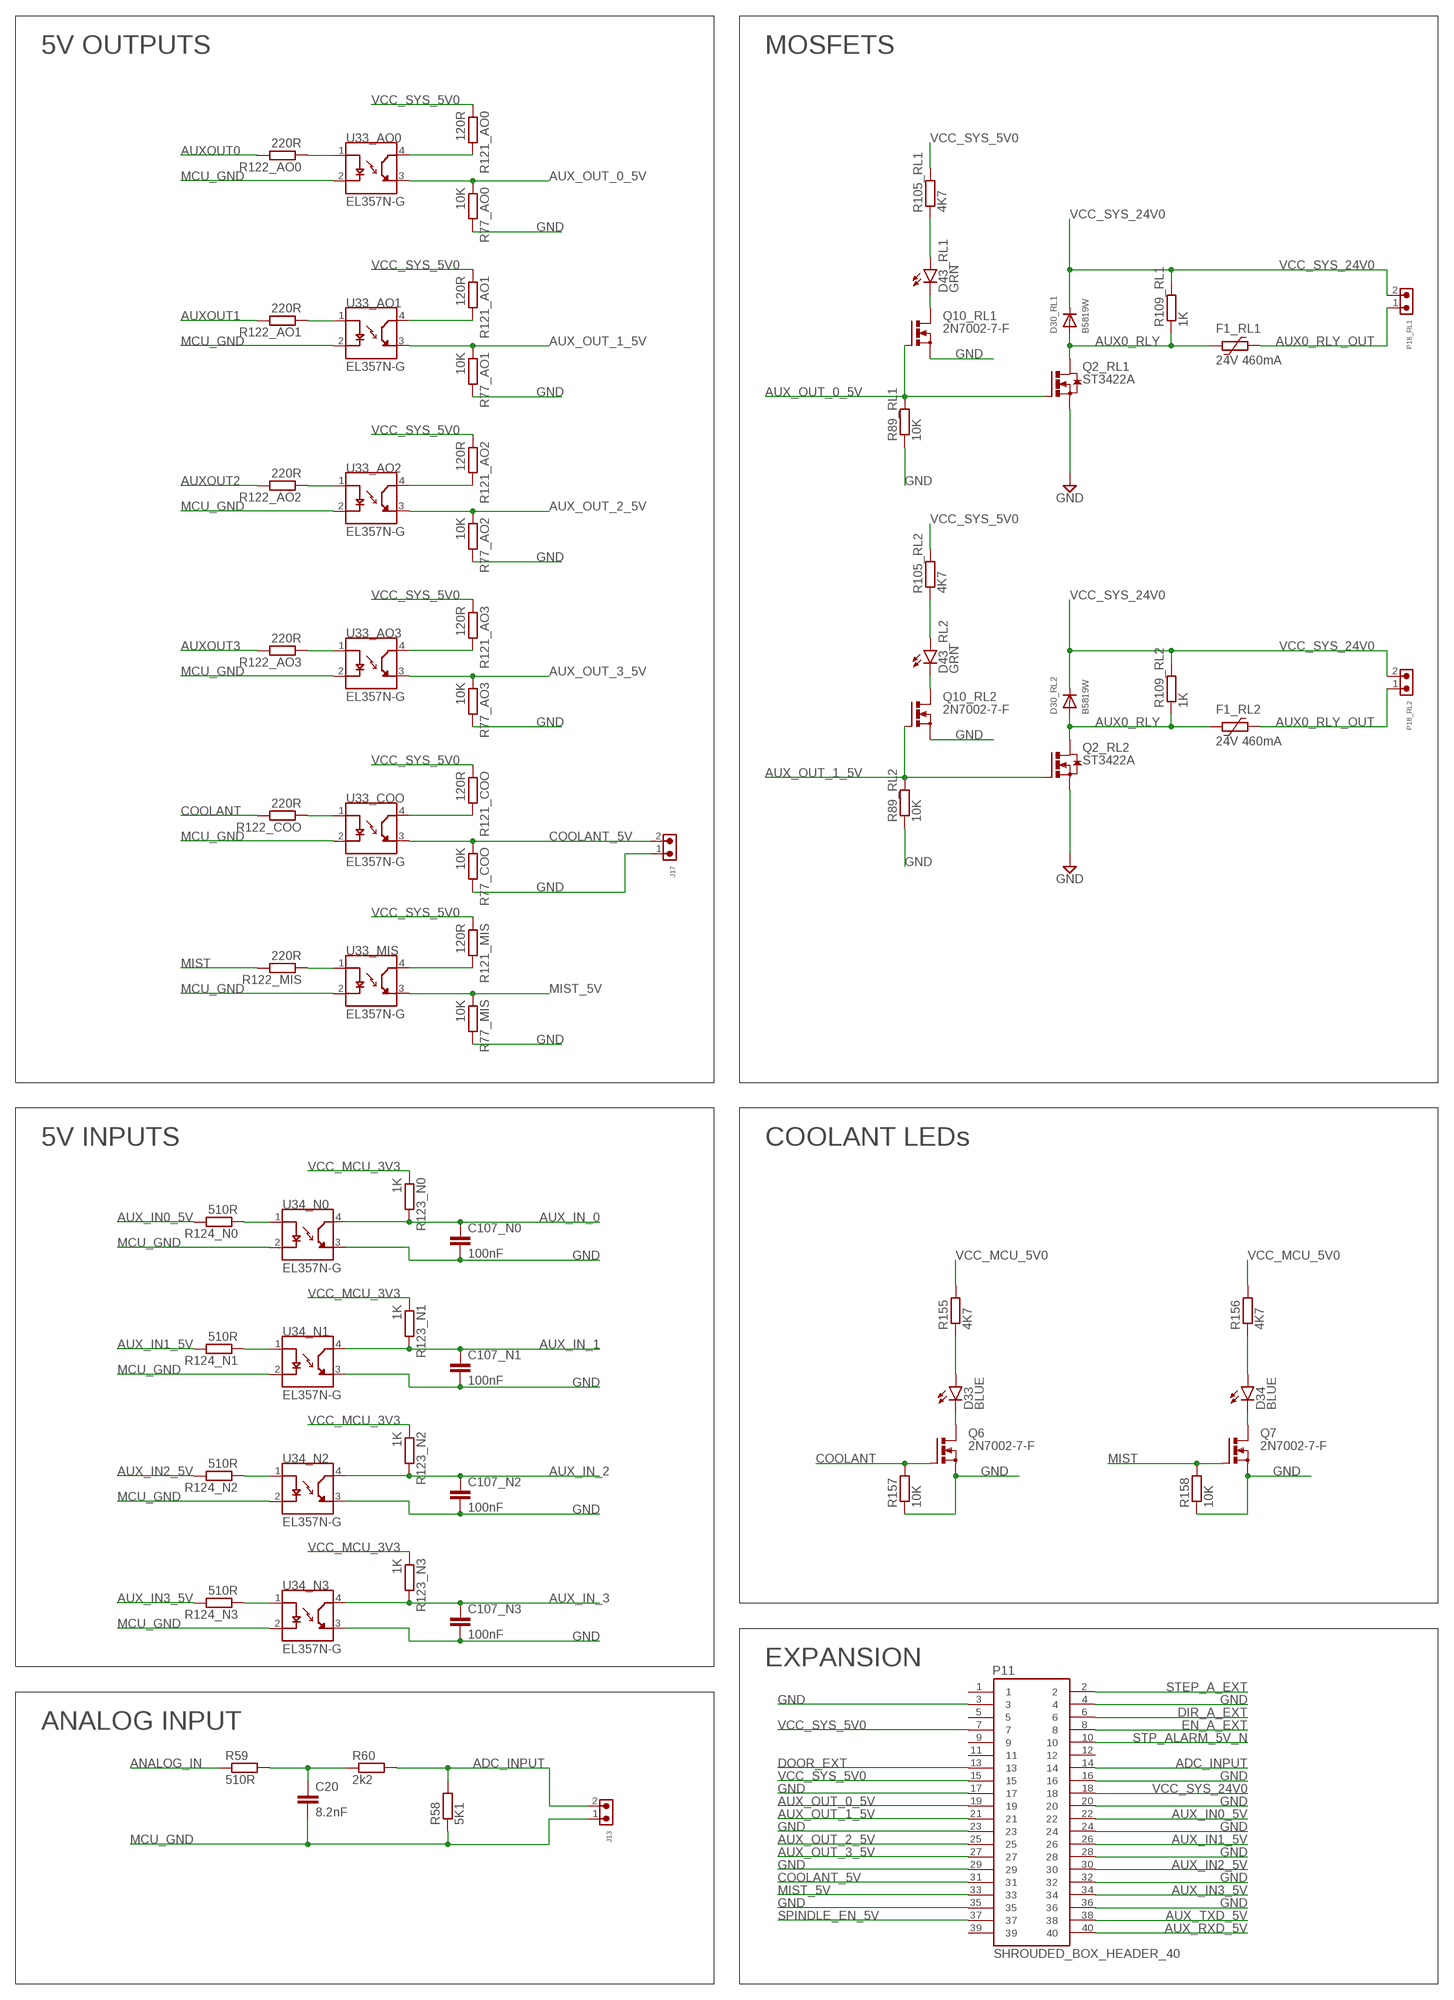
[diagram p6: schematic, sheet 6, part 1 of 2]
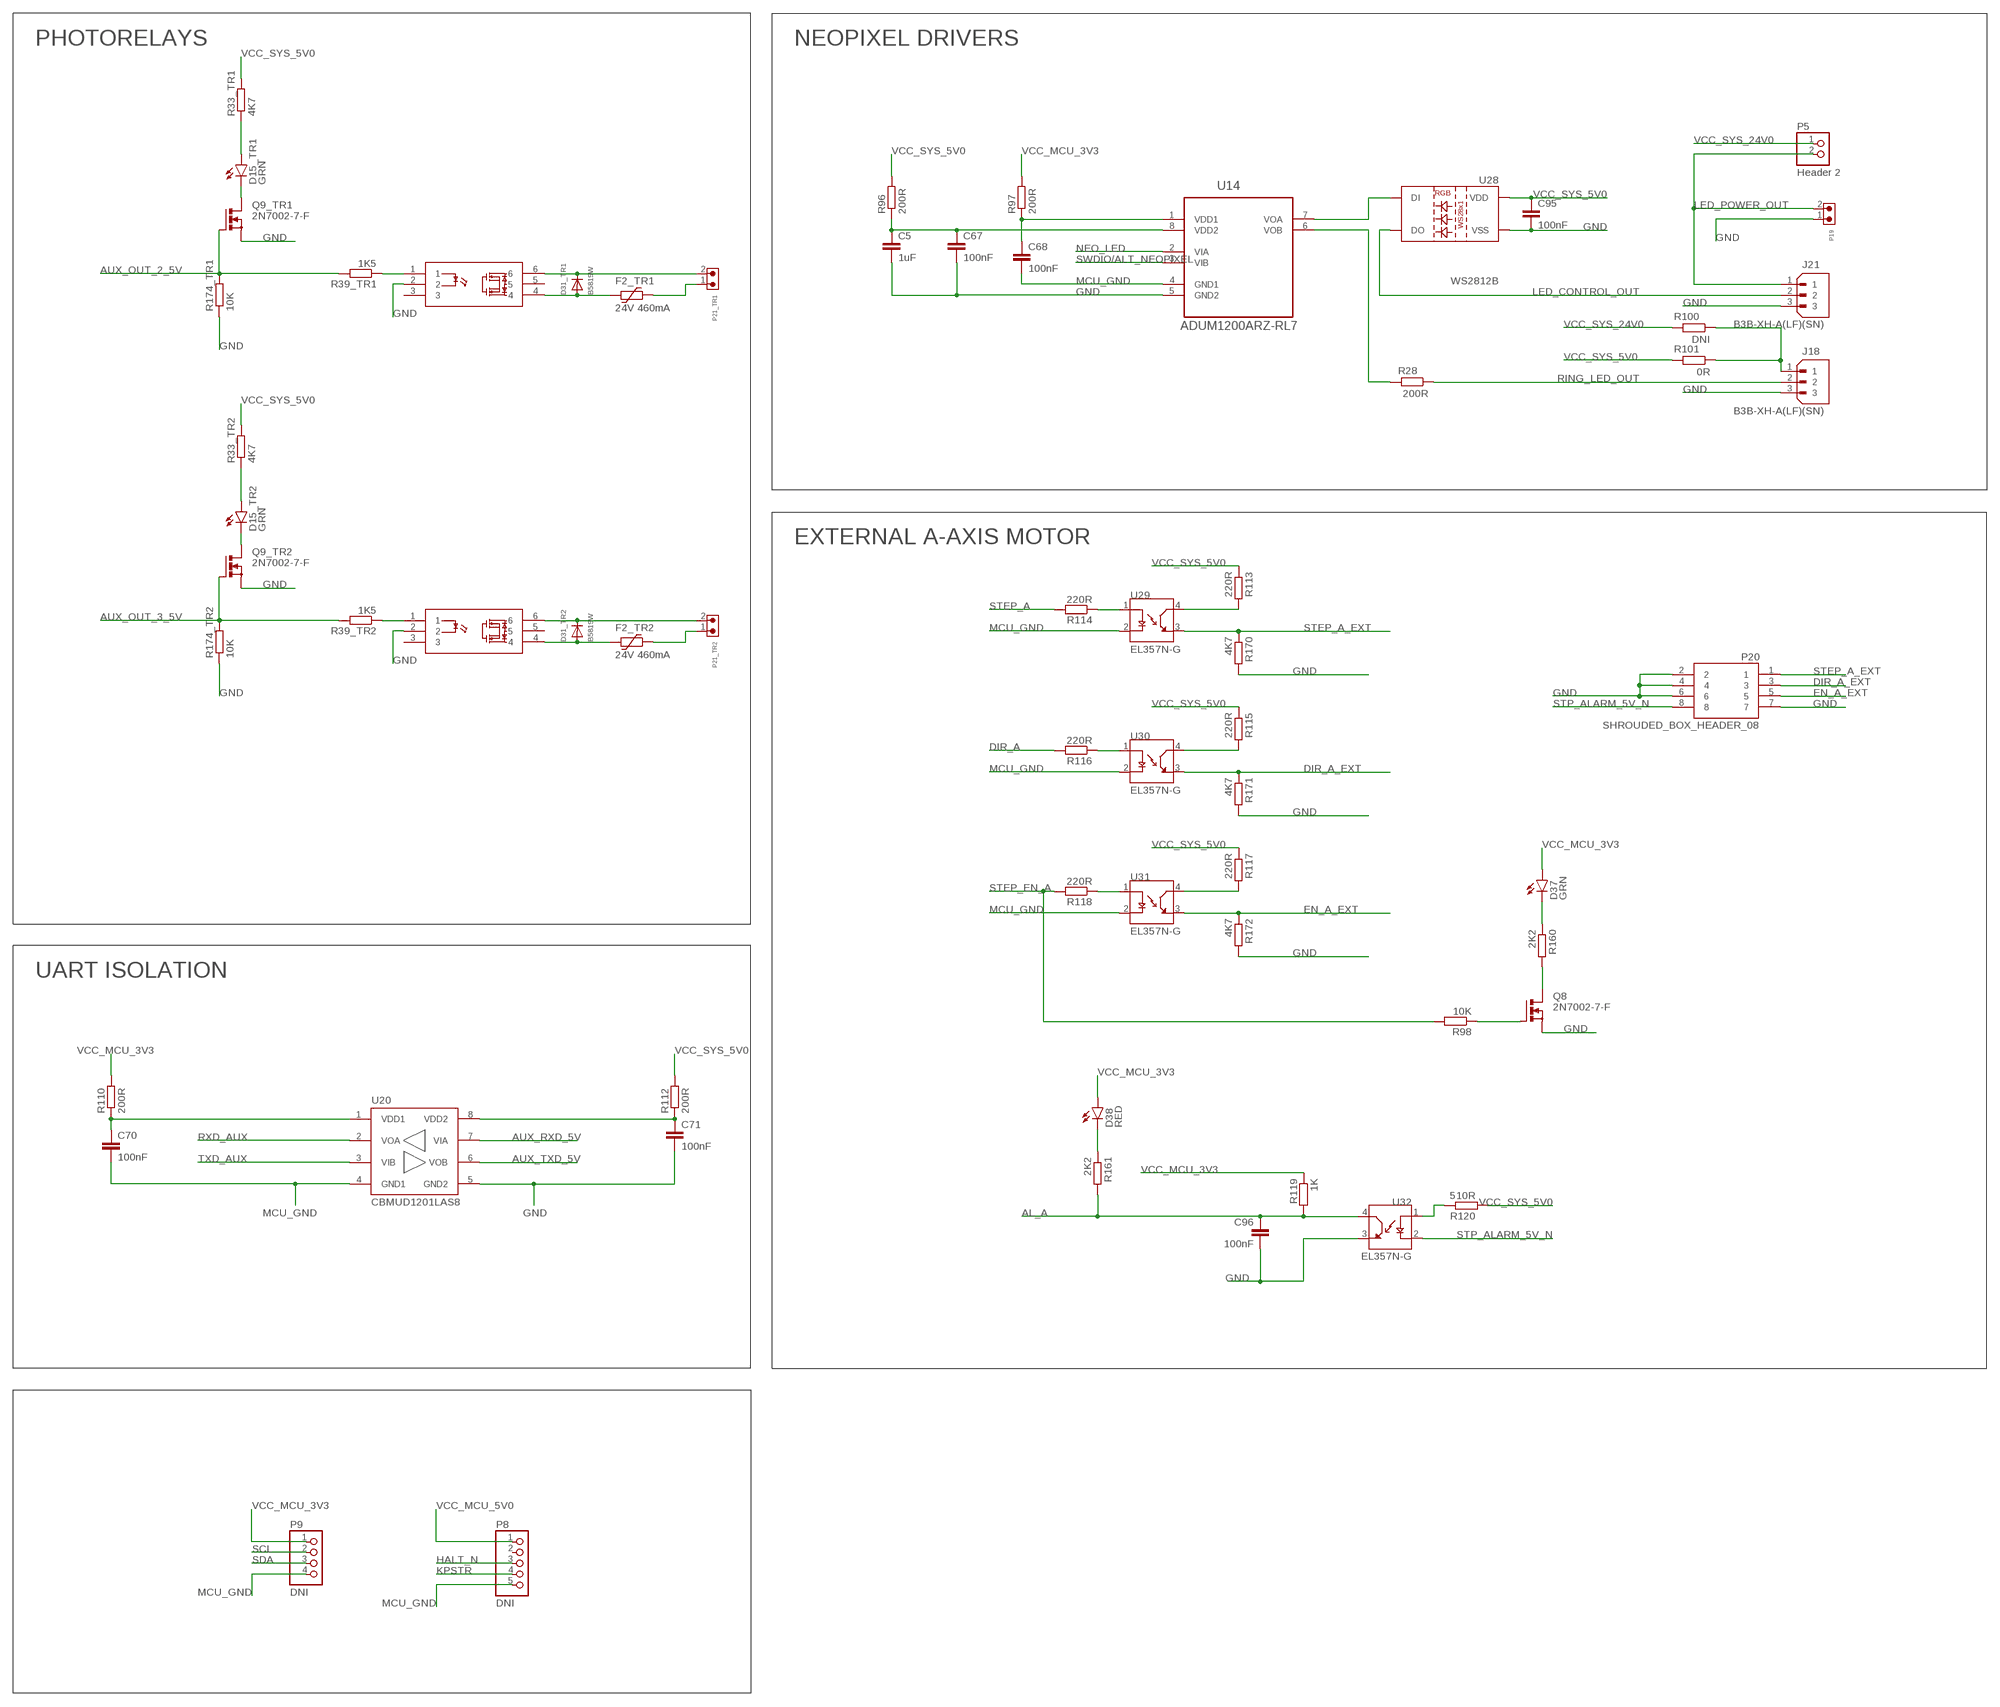
[diagram p7: schematic, sheet 6, part 2 of 2]

### Parts
C5  1uF  C-EUC0603K  [C0603K]
C20  8.2nF  C-EUC0603K  [C0603K]
C67  100nF  C-EUC0603K  [C0603K]
C68  100nF  C-EUC0603K  [C0603K]
C70  100nF  C-EUC0402  [C0402]
C71  100nF  C-EUC0402  [C0402]
C95  100nF  C-EUC0603K  [C0603K]
C96  100nF  C-EUC0402  [C0402]
C107_N0  100nF  C-EUC0402  [C0402]
C107_N1  100nF  C-EUC0402  [C0402]
C107_N2  100nF  C-EUC0402  [C0402]
C107_N3  100nF  C-EUC0402  [C0402]
D15_TR1  GRN  LEDCHIP-LED0603  [CHIP-LED0603]
D15_TR2  GRN  LEDCHIP-LED0603  [CHIP-LED0603]
D30_RL1  B5819W  [SOD123FL]
D30_RL2  B5819W  [SOD123FL]
D31_TR1  B5819W  [SOD123FL]
D31_TR2  B5819W  [SOD123FL]
D33  BLUE  LEDCHIP-LED0603  [CHIP-LED0603]
D34  BLUE  LEDCHIP-LED0603  [CHIP-LED0603]
D37  GRN  LEDCHIP-LED0603  [CHIP-LED0603]
D38  RED  LEDCHIP-LED0603  [CHIP-LED0603]
D43_RL1  GRN  LEDCHIP-LED0603  [CHIP-LED0603]
D43_RL2  GRN  LEDCHIP-LED0603  [CHIP-LED0603]
F1_RL1  24V 460mA  1206L050  [1206L]
F1_RL2  24V 460mA  1206L050  [1206L]
F2_TR1  24V 460mA  1206L050  [1206L]
F2_TR2  24V 460mA  1206L050  [1206L]
J13  WJ15EDGK-3.81-2P  DB2EVC-3.81-2P-GN  [DB2EVC-3.81-2P-GN]
J17  WJ15EDGK-3.81-2P  DB2EVC-3.81-2P-GN  [DB2EVC-3.81-2P-GN]
J18  B3B-XH-A(LF)(SN)  [JST_B3B-XH-A(LF)(SN)]
J21  B3B-XH-A(LF)(SN)  [JST_B3B-XH-A(LF)(SN)]
K1_TR1  TLP3109A  [TLP3109A]
K1_TR2  TLP3109A  [TLP3109A]
P5  Header 2  PINHD-1X2  [1X02]
P8  DNI  PINHD-1X5  [1X05]
P9  DNI  PINHD-1X4  [1X04]
P11  SHROUDED_BOX_HEADER_40  [SHROUDED_BOX_HEADER_40]
P18_RL1  WJ15EDGK-3.81-2P  DB2EVC-3.81-2P-GN  [DB2EVC-3.81-2P-GN]
P18_RL2  WJ15EDGK-3.81-2P  DB2EVC-3.81-2P-GN  [DB2EVC-3.81-2P-GN]
P19  WJ15EDGK-3.81-2P  DB2EVC-3.81-2P-GN  [DB2EVC-3.81-2P-GN]
P20  SHROUDED_BOX_HEADER_08  [SHROUDED_BOX_HEADER_08]
P21_TR1  WJ15EDGK-3.81-2P  DB2EVC-3.81-2P-GN  [DB2EVC-3.81-2P-GN]
P21_TR2  WJ15EDGK-3.81-2P  DB2EVC-3.81-2P-GN  [DB2EVC-3.81-2P-GN]
Q2_RL1  ST3422A  [SOT-23]
Q2_RL2  ST3422A  [SOT-23]
Q6  2N7002-7-F  [SOT-23]
Q7  2N7002-7-F  [SOT-23]
Q8  2N7002-7-F  [SOT-23]
Q9_TR1  2N7002-7-F  [SOT-23]
Q9_TR2  2N7002-7-F  [SOT-23]
Q10_RL1  2N7002-7-F  [SOT-23]
Q10_RL2  2N7002-7-F  [SOT-23]
R28  200R  R-EU_R0402  [R0402]
R33_TR1  4K7  R-EU_R0402  [R0402]
R33_TR2  4K7  R-EU_R0402  [R0402]
R39_TR1  1K5  R-EU_R0402  [R0402]
R39_TR2  1K5  R-EU_R0402  [R0402]
R58  5K1  R-EU_R0402  [R0402]
R59  510R  R-EU_R0402  [R0402]
R60  2k2  R-EU_R0402  [R0402]
R77_AO0  10K  R-EU_R0402  [R0402]
R77_AO1  10K  R-EU_R0402  [R0402]
R77_AO2  10K  R-EU_R0402  [R0402]
R77_AO3  10K  R-EU_R0402  [R0402]
R77_COO  10K  R-EU_R0402  [R0402]
R77_MIS  10K  R-EU_R0402  [R0402]
R89_RL1  10K  R-EU_R0402  [R0402]
R89_RL2  10K  R-EU_R0402  [R0402]
R96  200R  R-EU_R0402  [R0402]
R97  200R  R-EU_R0603  [R0603]
R98  10K  R-EU_R0603  [R0603]
R100  DNI  R-EU_R0402  [R0402]
R101  0R  R-EU_R0402  [R0402]
R105_RL1  4K7  R-EU_R0402  [R0402]
R105_RL2  4K7  R-EU_R0402  [R0402]
R109_RL1  1K  R-EU_R0603  [R0603]
R109_RL2  1K  R-EU_R0603  [R0603]
R110  200R  R-EU_R0402  [R0402]
R112  200R  R-EU_R0402  [R0402]
R113  220R  R-EU_R0402  [R0402]
R114  220R  R-EU_R0402  [R0402]
R115  220R  R-EU_R0402  [R0402]
R116  220R  R-EU_R0603  [R0603]
R117  220R  R-EU_R0402  [R0402]
R118  220R  R-EU_R0402  [R0402]
R119  1K  R-EU_R0402  [R0402]
R120  510R  R-EU_R0402  [R0402]
R121_AO0  120R  R-EU_R0402  [R0402]
R121_AO1  120R  R-EU_R0402  [R0402]
R121_AO2  120R  R-EU_R0402  [R0402]
R121_AO3  120R  R-EU_R0402  [R0402]
R121_COO  120R  R-EU_R0402  [R0402]
R121_MIS  120R  R-EU_R0402  [R0402]
R122_AO0  220R  R-EU_R0402  [R0402]
R122_AO1  220R  R-EU_R0402  [R0402]
R122_AO2  220R  R-EU_R0402  [R0402]
R122_AO3  220R  R-EU_R0402  [R0402]
R122_COO  220R  R-EU_R0402  [R0402]
R122_MIS  220R  R-EU_R0402  [R0402]
R123_N0  1K  R-EU_R0402  [R0402]
R123_N1  1K  R-EU_R0402  [R0402]
R123_N2  1K  R-EU_R0402  [R0402]
R123_N3  1K  R-EU_R0402  [R0402]
R124_N0  510R  R-EU_R0402  [R0402]
R124_N1  510R  R-EU_R0402  [R0402]
R124_N2  510R  R-EU_R0402  [R0402]
R124_N3  510R  R-EU_R0402  [R0402]
R155  4K7  R-EU_R0402  [R0402]
R156  4K7  R-EU_R0402  [R0402]
R157  10K  R-EU_R0603  [R0603]
R158  10K  R-EU_R0603  [R0603]
R160  2K2  R-EU_R0402  [R0402]
R161  2K2  R-EU_R0402  [R0402]
R170  4K7  R-EU_R0402  [R0402]
R171  4K7  R-EU_R0402  [R0402]
R172  4K7  R-EU_R0402  [R0402]
R174_TR1  10K  R-EU_R0402  [R0402]
R174_TR2  10K  R-EU_R0402  [R0402]
U14  ADUM1200ARZ-RL7  [SOIC127P600X175-8N]
U20  CBMUD1201LAS8  [SOIC-8]
U28  WS2812B  [WS2812B]
U29  EL357N-G  [OPTO_EL357N-G]
U30  EL357N-G  [OPTO_EL357N-G]
U31  EL357N-G  [OPTO_EL357N-G]
U32  EL357N-G  [OPTO_EL357N-G]
U33_AO0  EL357N-G  [OPTO_EL357N-G]
U33_AO1  EL357N-G  [OPTO_EL357N-G]
U33_AO2  EL357N-G  [OPTO_EL357N-G]
U33_AO3  EL357N-G  [OPTO_EL357N-G]
U33_COO  EL357N-G  [OPTO_EL357N-G]
U33_MIS  EL357N-G  [OPTO_EL357N-G]
U34_N0  EL357N-G  [OPTO_EL357N-G]
U34_N1  EL357N-G  [OPTO_EL357N-G]
U34_N2  EL357N-G  [OPTO_EL357N-G]
U34_N3  EL357N-G  [OPTO_EL357N-G]

### Nets
ADC_INPUT: J13.2 P11.14 R58.2 R60.2
AL_A: C96.1 R119.2 R161.2 U32.4(CT) ; also sheet 1,3
ANALOG_IN: R59.1 ; also sheet 1,3
AUX0_RLY: D30_RL1.A D30_RL2.A F1_RL1.2 F1_RL2.2 Q2_RL1.P3(D) Q2_RL2.P3(D) R109_RL1.1 R109_RL2.1
AUX0_RLY_OUT: F1_RL1.1 F1_RL2.1 P18_RL1.1 P18_RL2.1
AUX_IN0_5V: P11.22 R124_N0.2
AUX_IN1_5V: P11.26 R124_N1.2
AUX_IN2_5V: P11.30 R124_N2.2
AUX_IN3_5V: P11.34 R124_N3.2
AUX_IN_0: C107_N0.1 R123_N0.2 U34_N0.4(CT) ; also sheet 1,3
AUX_IN_1: C107_N1.1 R123_N1.2 U34_N1.4(CT) ; also sheet 1,3
AUX_IN_2: C107_N2.1 R123_N2.2 U34_N2.4(CT) ; also sheet 1,3
AUX_IN_3: C107_N3.1 R123_N3.2 U34_N3.4(CT) ; also sheet 1,3
AUX_OUT_0_5V: P11.19 Q2_RL1.P1(G) Q10_RL1.P1(G) R77_AO0.1 R89_RL1.2 U33_AO0.3(ET)
AUX_OUT_1_5V: P11.21 Q2_RL2.P1(G) Q10_RL2.P1(G) R77_AO1.1 R89_RL2.2 U33_AO1.3(ET)
AUX_OUT_2_5V: P11.25 Q9_TR1.P1(G) R39_TR1.2 R77_AO2.1 R174_TR1.2 U33_AO2.3(ET)
AUX_OUT_3_5V: P11.27 Q9_TR2.P1(G) R39_TR2.2 R77_AO3.1 R174_TR2.2 U33_AO3.3(ET)
AUX_RXD_5V: P11.40 U20.7(VIA)
AUX_TXD_5V: P11.38 U20.6(VOB)
AUXOUT0: R122_AO0.2 ; also sheet 1,3
AUXOUT1: R122_AO1.2 ; also sheet 1,3
AUXOUT2: R122_AO2.2 ; also sheet 1,3
AUXOUT3: R122_AO3.2 ; also sheet 1,3
COOLANT: Q6.P1(G) R122_COO.2 R157.2 ; also sheet 3
COOLANT_5V: J17.2 P11.31 R77_COO.1 U33_COO.3(ET)
DIR_A: R116.2 ; also sheet 1,3
DIR_A_EXT: P11.6 P20.3 R171.1 U30.3(ET)
DOOR_EXT: P11.13 ; also sheet 8
EN_A_EXT: P11.8 P20.5 R172.1 U31.3(ET)
GND: C5.2 C67.2 C71.2 C95.2 C96.2 C107_N0.2 C107_N1.2 C107_N2.2 C107_N3.2 J17.1 J18.3 J21.3 K1_TR1.2 K1_TR2.2 P11.3 P11.4 P11.16 P11.17 P11.20 P11.23 P11.24 P11.28 P11.29 P11.32 P11.35 P11.36 P19.1 P20.2 P20.4 P20.6 P20.7 Q2_RL1.P2(S) Q2_RL2.P2(S) Q6.P2(S) Q7.P2(S) Q8.P2(S) Q9_TR1.P2(S) Q9_TR2.P2(S) Q10_RL1.P2(S) Q10_RL2.P2(S) R77_AO0.2 R77_AO1.2 R77_AO2.2 R77_AO3.2 R77_COO.2 R77_MIS.2 R89_RL1.1 R89_RL2.1 R157.1 R158.1 R170.2 R171.2 R172.2 R174_TR1.1 R174_TR2.1 U14.5(GND2) U20.5(GND2) U28.3(VSS) U32.3(ET) U34_N0.3(ET) U34_N1.3(ET) U34_N2.3(ET) U34_N3.3(ET) ; also sheet 4,5,7,8,9,10,11,12,14
HALT_N: P8.3 ; also sheet 1,2,3,7
KPSTR: P8.4 ; also sheet 12
LED_CONTROL_OUT: J21.2 U28.2(DO)
LED_POWER_OUT: J21.1 P5.2 P19.2
MCU_GND: C20.2 C68.2 C70.2 J13.1 P8.5 P9.4 R58.1 U14.4(GND1) U20.4(GND1) U29.2(C) U30.2(C) U31.2(C) U33_AO0.2(C) U33_AO1.2(C) U33_AO2.2(C) U33_AO3.2(C) U33_COO.2(C) U33_MIS.2(C) U34_N0.2(C) U34_N1.2(C) U34_N2.2(C) U34_N3.2(C) ; also sheet 2,3,5,9,11,12,13,14
MIST: Q7.P1(G) R122_MIS.2 R158.2 ; also sheet 3
MIST_5V: P11.33 R77_MIS.1 U33_MIS.3(ET)
N$41: R122_AO0.1 U33_AO0.1(A)
N$42: D43_RL1.A R105_RL1.1
N$43: R122_MIS.1 U33_MIS.1(A)
N$44: R121_AO0.2 U33_AO0.4(CT)
N$45: R122_AO1.1 U33_AO1.1(A)
N$46: D43_RL1.C Q10_RL1.P3(D)
N$47: D15_TR1.A R33_TR1.1
N$48: R121_AO1.2 U33_AO1.4(CT)
N$49: R122_AO2.1 U33_AO2.1(A)
N$50: D43_RL2.A R105_RL2.1
N$51: D43_RL2.C Q10_RL2.P3(D)
N$52: R121_AO2.2 U33_AO2.4(CT)
N$53: R122_AO3.1 U33_AO3.1(A)
N$54: R121_MIS.2 U33_MIS.4(CT)
N$55: D15_TR1.C Q9_TR1.P3(D)
N$56: R121_AO3.2 U33_AO3.4(CT)
N$57: R122_COO.1 U33_COO.1(A)
N$58: K1_TR1.1 R39_TR1.1
N$59: D31_TR1.C K1_TR1.6 P21_TR1.2
N$60: R121_COO.2 U33_COO.4(CT)
N$61: D31_TR1.A F2_TR1.2 K1_TR1.4
N$62: F2_TR1.1 P21_TR1.1
N$63: D15_TR2.A R33_TR2.1
N$64: D15_TR2.C Q9_TR2.P3(D)
N$65: K1_TR2.1 R39_TR2.1
N$66: D31_TR2.C K1_TR2.6 P21_TR2.2
N$67: D31_TR2.A F2_TR2.2 K1_TR2.4
N$68: F2_TR2.1 P21_TR2.1
N$69: R124_N0.1 U34_N0.1(A)
N$70: R124_N1.1 U34_N1.1(A)
N$71: R124_N2.1 U34_N2.1(A)
N$72: R120.1 U32.1(A)
N$73: D33.A R155.1
N$74: D33.C Q6.P3(D)
N$75: D34.A R156.1
N$76: D34.C Q7.P3(D)
N$77: C5.1 C67.1 R96.1 U14.8(VDD2)
N$78: C68.1 R97.1 U14.1(VDD1)
N$79: C70.1 R110.1 U20.1(VDD1)
N$80: C71.1 R112.1 U20.8(VDD2)
N$81: R28.2 U14.6(VOB)
N$82: U14.7(VOA) U28.4(DI)
N$83: R114.1 U29.1(A)
N$84: R113.2 U29.4(CT)
N$85: R116.1 U30.1(A)
N$86: R115.2 U30.4(CT)
N$87: R118.1 U31.1(A)
N$88: R117.2 U31.4(CT)
N$89: D37.C R160.1
N$90: Q8.P3(D) R160.2
N$91: Q8.P1(G) R98.1
N$92: D38.C R161.1
N$93: C20.1 R59.2 R60.1
N$160: J18.1 R100.1 R101.1
N$162: R124_N3.1 U34_N3.1(A)
NEO_LED: U14.2(VIA) ; also sheet 1,3
RING_LED_OUT: J18.2 R28.1
RXD_AUX: U20.2(VOA) ; also sheet 1,3
SCL: P9.2 ; also sheet 1,3
SDA: P9.3 ; also sheet 1,3
SPINDLE_EN_5V: P11.37 ; also sheet 11
STEP_A: R114.2 ; also sheet 1,3
STEP_A_EXT: P11.2 P20.1 R170.1 U29.3(ET)
STEP_EN_A: R98.2 R118.2 ; also sheet 1,3
STP_ALARM_5V_N: P11.10 P20.8 U32.2(C)
SWDIO/ALT_NEOPIXEL: U14.3(VIB) ; also sheet 1,3,4
TXD_AUX: U20.3(VIB) ; also sheet 1,3
VCC_MCU_3V3: D37.A D38.A P9.1 R97.2 R110.2 R119.1 R123_N0.1 R123_N1.1 R123_N2.1 R123_N3.1 ; also sheet 2,3,4,5,7,8,9,11,12,14
VCC_MCU_5V0: P8.1 R155.2 R156.2 ; also sheet 9,11,12
VCC_SYS_5V0: C95.1 P11.7 P11.15 R33_TR1.2 R33_TR2.2 R96.2 R101.2 R105_RL1.2 R105_RL2.2 R112.2 R113.1 R115.1 R117.1 R120.2 R121_AO0.1 R121_AO1.1 R121_AO2.1 R121_AO3.1 R121_COO.1 R121_MIS.1 U28.1(VDD) ; also sheet 5,7,8,9,10,11,14
VCC_SYS_24V0: D30_RL1.C D30_RL2.C P5.1 P11.18 P18_RL1.2 P18_RL2.2 R100.2 R109_RL1.2 R109_RL2.2 ; also sheet 8,9,10
Unconnected: K1_TR1.3 K1_TR1.5 K1_TR2.3 K1_TR2.5 P8.2 P11.1 P11.5 P11.9 P11.11 P11.12 P11.39

### Notes on the sheet
- Equiv to Page 9/27 of Longboard_32bit_ext_Schematic_B9_FULL_PLACE.PDF
  
  Includes Page 6/27's Misc Switches
  
  Includes Page 10/27's Mosfet output stage
  
  Includes Page 11/27's Neopixel Section
  
  Includes Page 12/27's External Stepper
  
  Includes Page 13/27's 5V Isolated Output block
  
  Includes Page 14/27's 5V Isolated Input block
  
  Includes Page 15/27's Optorelay block
- 5V OUTPUTS | MOSFETS | PHOTORELAYS | NEOPIXEL DRIVERS
- EXTERNAL A-AXIS MOTOR
- 5V INPUTS | COOLANT LEDs | UART ISOLATION
- EXPANSION
- ANALOG INPUT

## Sheet 7 of 14: Equiv to Page 16/17 of 27 of Longboard_32bit_ext_Schematic_B9_FULL_PLACE.PDF
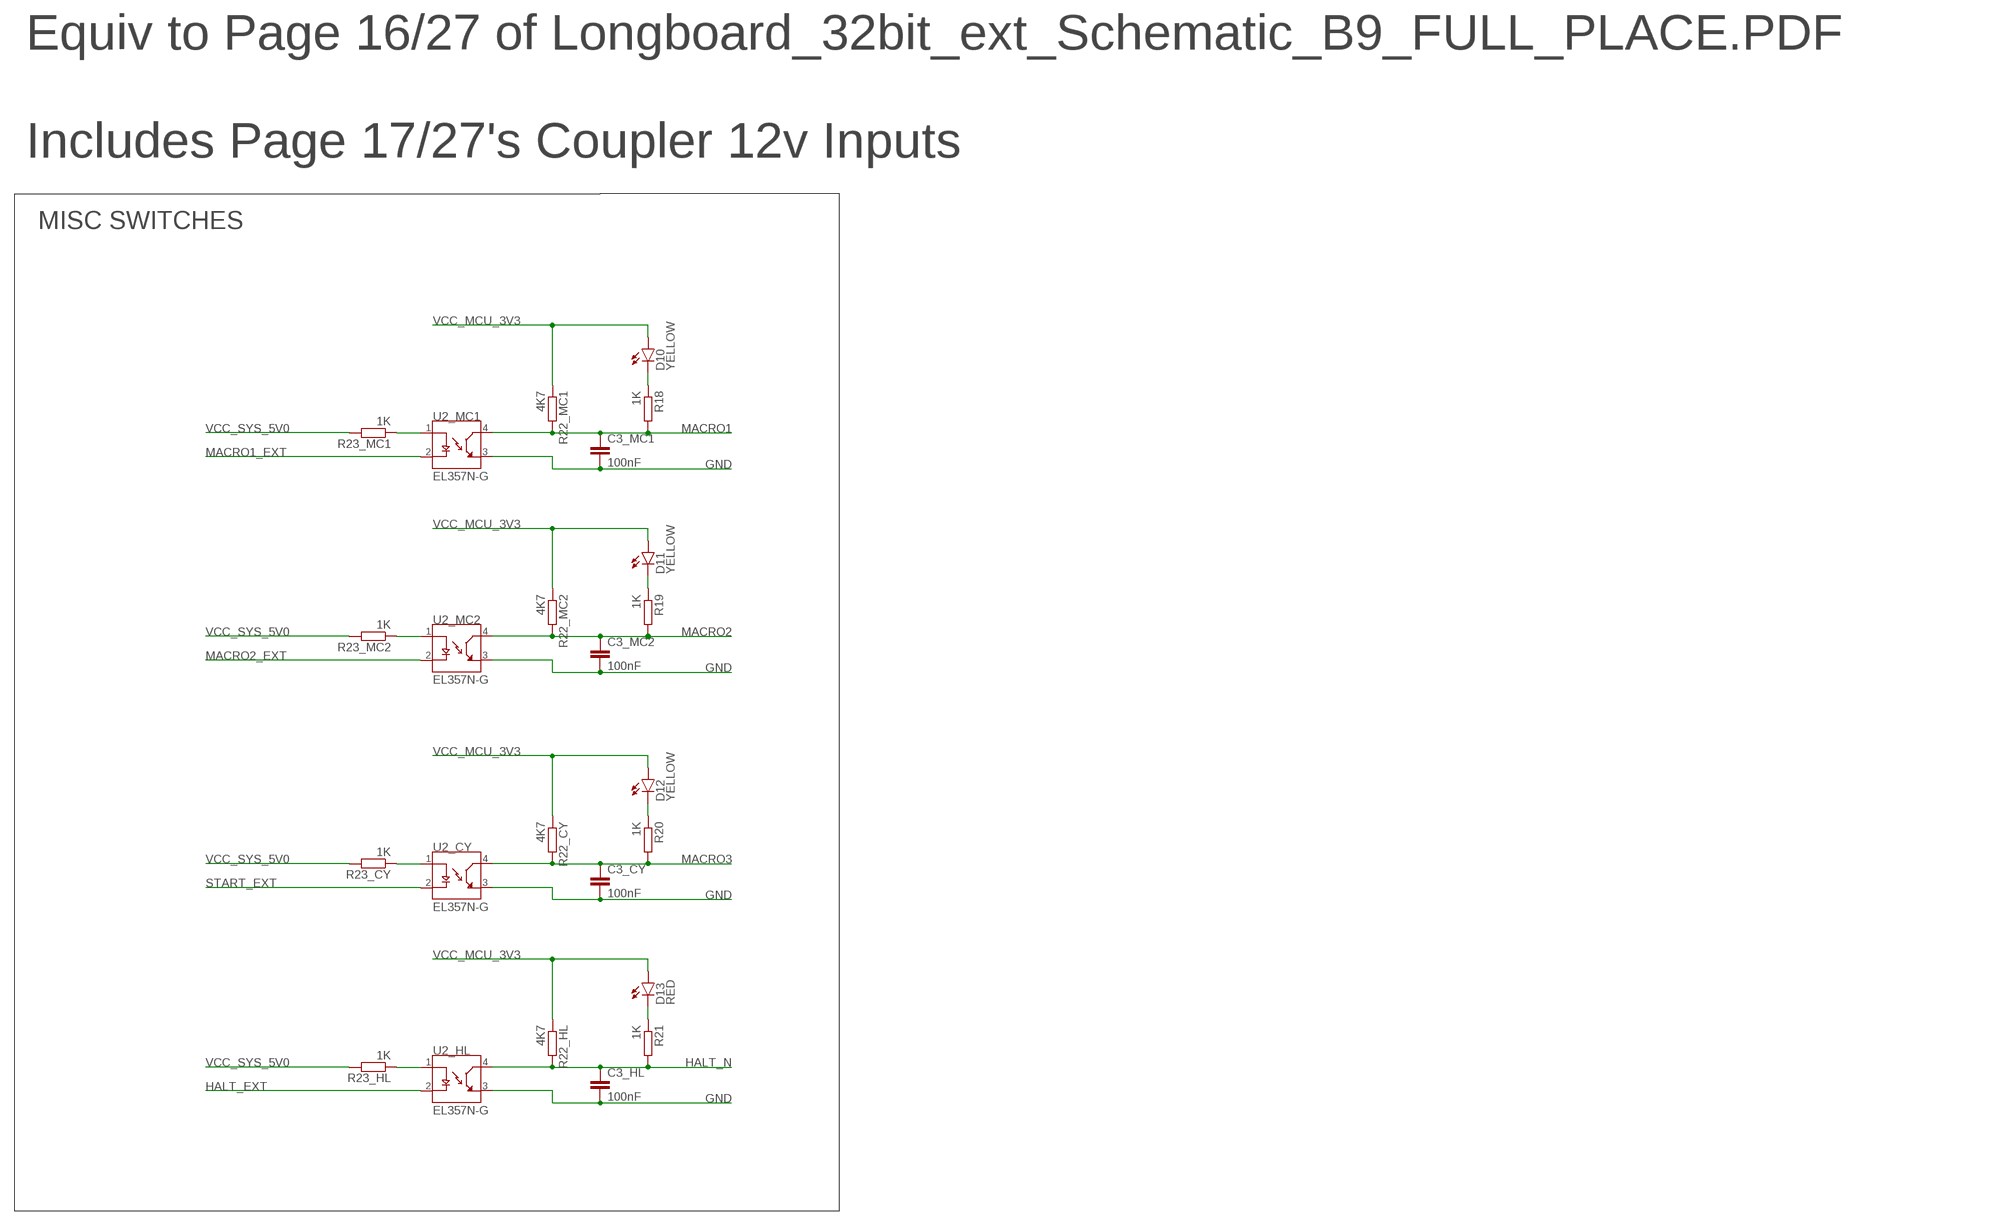
[diagram p8: schematic, sheet 7]

### Parts
C3_CY  100nF  C-EUC0603K  [C0603K]
C3_HL  100nF  C-EUC0402  [C0402]
C3_MC1  100nF  C-EUC0402  [C0402]
C3_MC2  100nF  C-EUC0402  [C0402]
D10  YELLOW  LEDCHIP-LED0603  [CHIP-LED0603]
D11  YELLOW  LEDCHIP-LED0603  [CHIP-LED0603]
D12  YELLOW  LEDCHIP-LED0603  [CHIP-LED0603]
D13  RED  LEDCHIP-LED0603  [CHIP-LED0603]
R18  1K  R-EU_R0402  [R0402]
R19  1K  R-EU_R0402  [R0402]
R20  1K  R-EU_R0402  [R0402]
R21  1K  R-EU_R0402  [R0402]
R22_CY  4K7  R-EU_R0603  [R0603]
R22_HL  4K7  R-EU_R0402  [R0402]
R22_MC1  4K7  R-EU_R0402  [R0402]
R22_MC2  4K7  R-EU_R0402  [R0402]
R23_CY  1K  R-EU_R0603  [R0603]
R23_HL  1K  R-EU_R0603  [R0603]
R23_MC1  1K  R-EU_R0603  [R0603]
R23_MC2  1K  R-EU_R0603  [R0603]
U2_CY  EL357N-G  [OPTO_EL357N-G]
U2_HL  EL357N-G  [OPTO_EL357N-G]
U2_MC1  EL357N-G  [OPTO_EL357N-G]
U2_MC2  EL357N-G  [OPTO_EL357N-G]

### Nets
GND: C3_CY.2 C3_HL.2 C3_MC1.2 C3_MC2.2 U2_CY.3(ET) U2_HL.3(ET) U2_MC1.3(ET) U2_MC2.3(ET) ; also sheet 4,5,6,8,9,10,11,12,14
HALT_EXT: U2_HL.2(C) ; also sheet 9
HALT_N: C3_HL.1 R21.2 R22_HL.2 U2_HL.4(CT) ; also sheet 1,2,3,6
MACRO1: C3_MC1.1 R18.2 R22_MC1.2 U2_MC1.4(CT) ; also sheet 1,3
MACRO1_EXT: U2_MC1.2(C) ; also sheet 9
MACRO2: C3_MC2.1 R19.2 R22_MC2.2 U2_MC2.4(CT) ; also sheet 1,3
MACRO2_EXT: U2_MC2.2(C) ; also sheet 9
MACRO3: C3_CY.1 R20.2 R22_CY.2 U2_CY.4(CT) ; also sheet 3
N$94: R23_MC1.1 U2_MC1.1(A)
N$95: D10.C R18.1
N$96: R23_MC2.1 U2_MC2.1(A)
N$97: D11.C R19.1
N$98: R23_CY.1 U2_CY.1(A)
N$99: D12.C R20.1
N$100: R23_HL.1 U2_HL.1(A)
N$101: D13.C R21.1
START_EXT: U2_CY.2(C) ; also sheet 9
VCC_MCU_3V3: D10.A D11.A D12.A D13.A R22_CY.1 R22_HL.1 R22_MC1.1 R22_MC2.1 ; also sheet 2,3,4,5,6,8,9,11,12,14
VCC_SYS_5V0: R23_CY.2 R23_HL.2 R23_MC1.2 R23_MC2.2 ; also sheet 5,6,8,9,10,11,14

### Notes on the sheet
- Equiv to Page 16/27 of Longboard_32bit_ext_Schematic_B9_FULL_PLACE.PDF
  
  Includes Page 17/27's Coupler 12v Inputs
- MISC SWITCHES

## Sheet 8 of 14: Equiv to Page 17/18 of 27 of Longboard_32bit_ext_Schematic_B9_FULL_PLACE.PDF
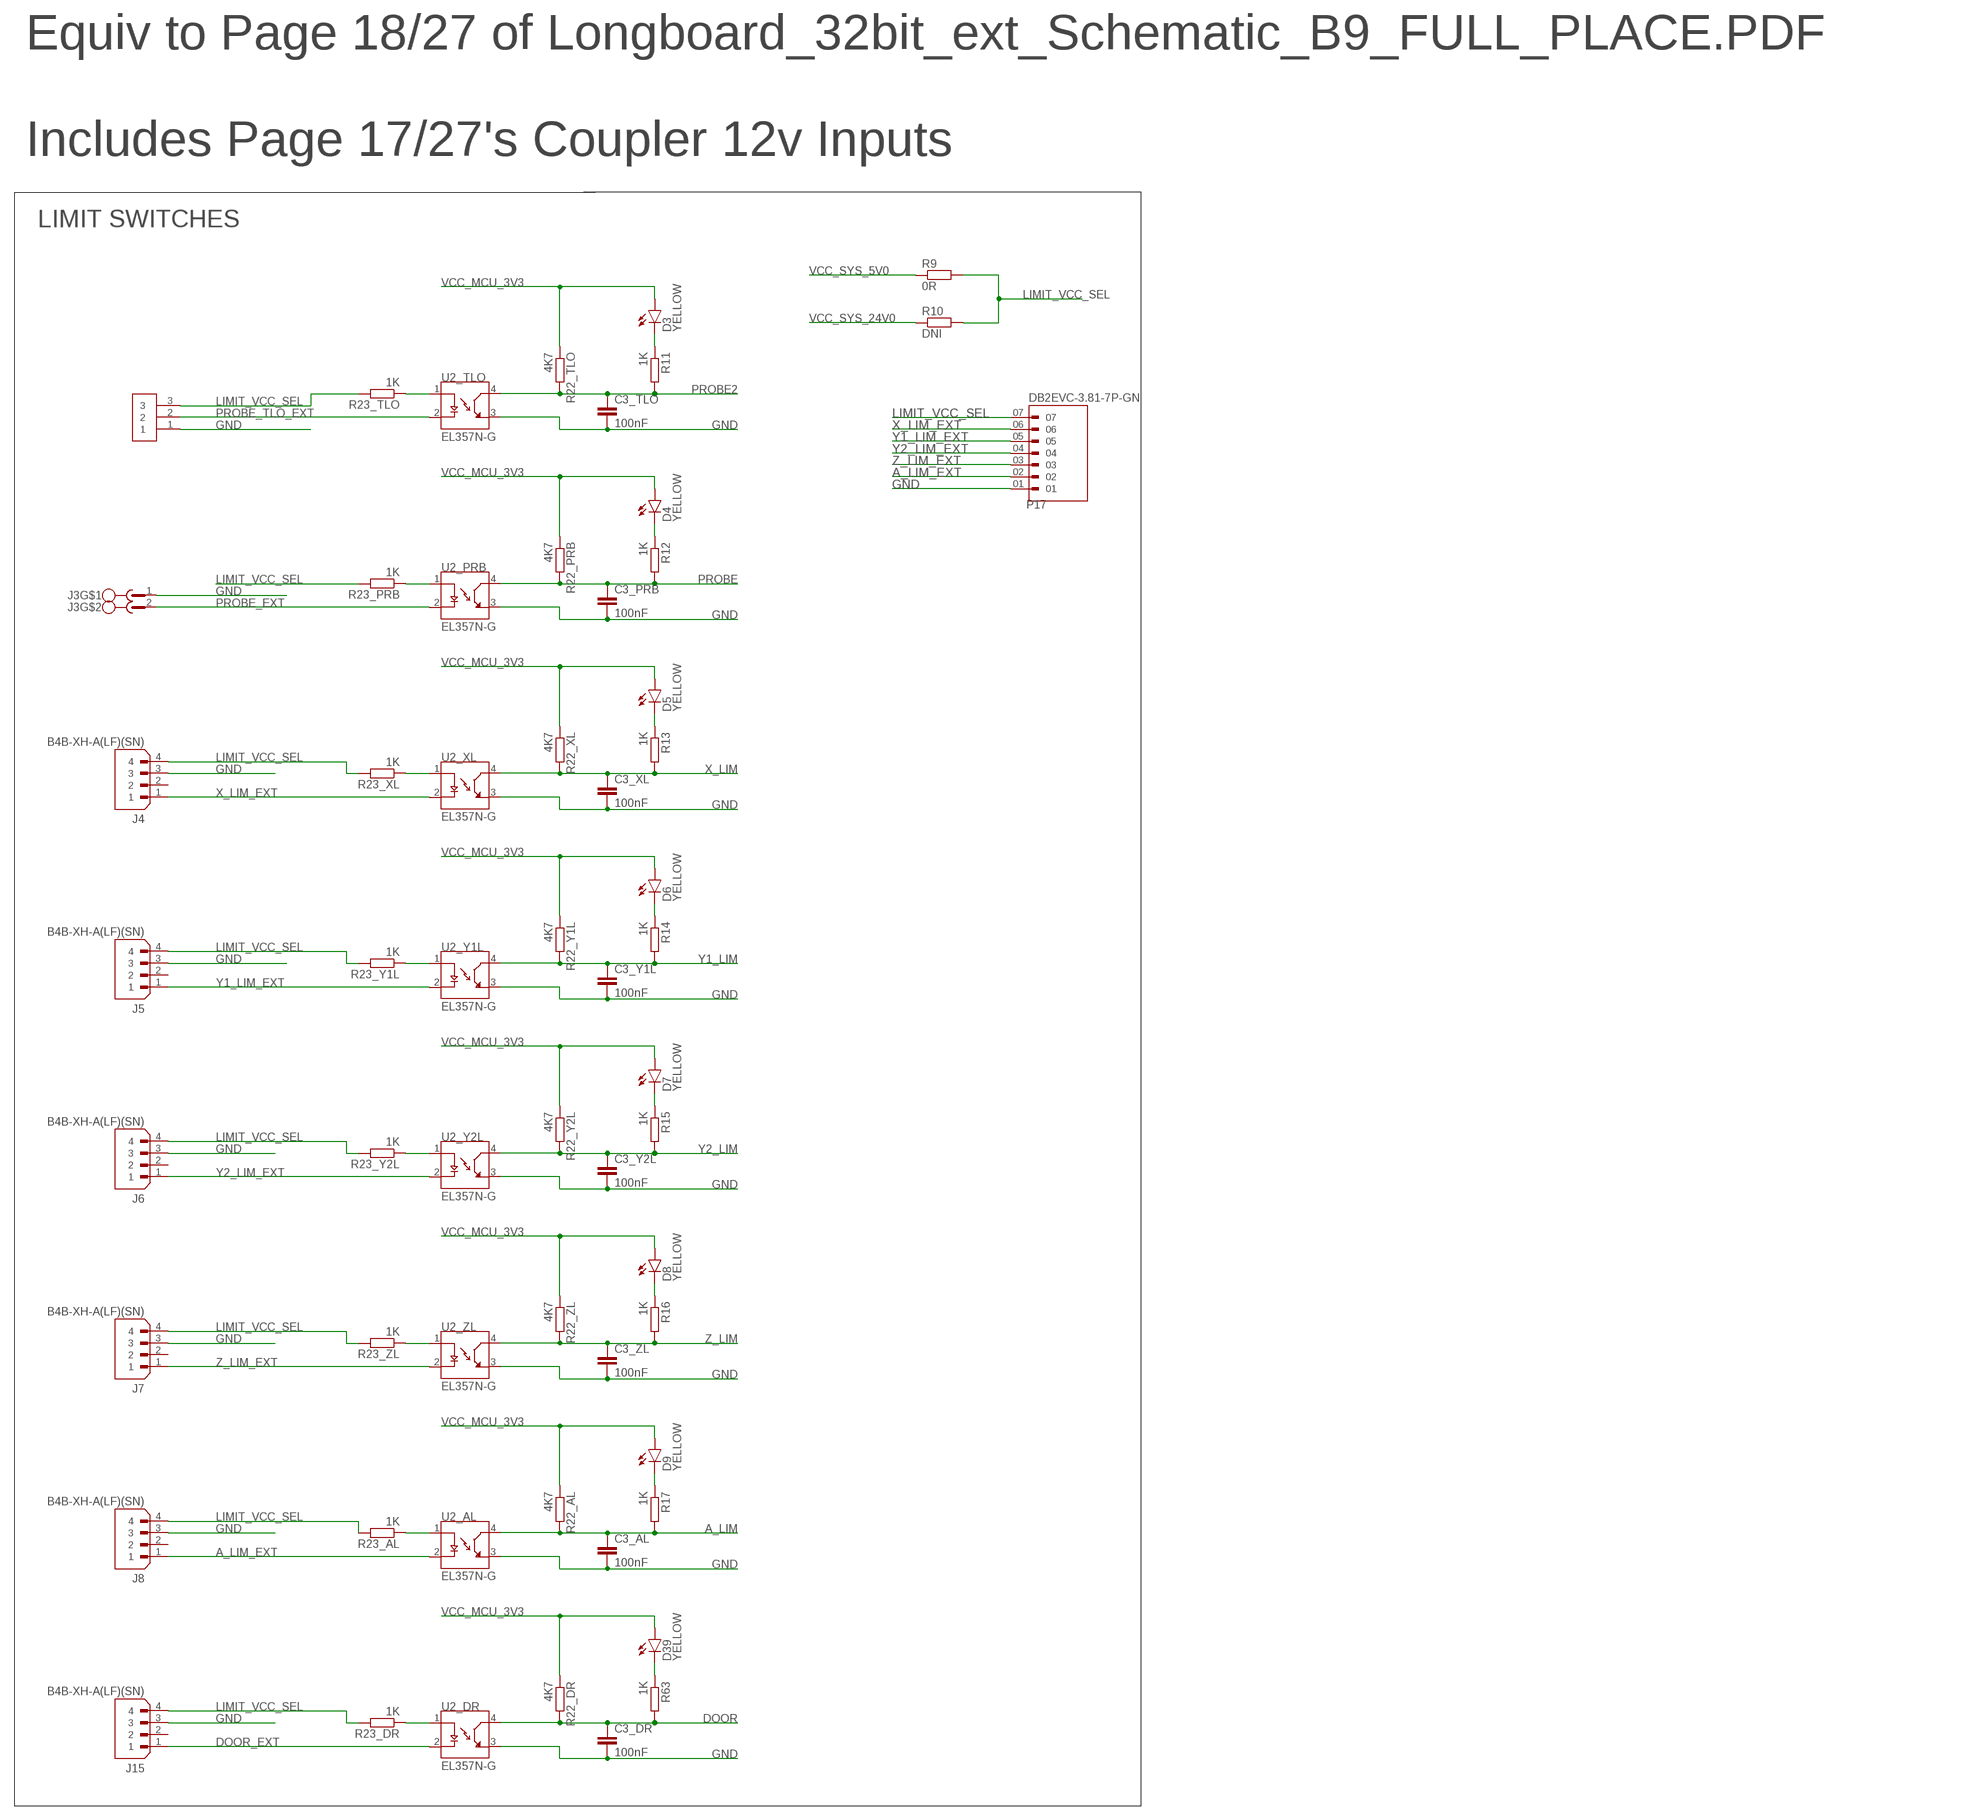
[diagram p9: schematic, sheet 8]

### Parts
C3_AL  100nF  C-EUC0402  [C0402]
C3_DR  100nF  C-EUC0402  [C0402]
C3_PRB  100nF  C-EUC0402  [C0402]
C3_TLO  100nF  C-EUC0402  [C0402]
C3_XL  100nF  C-EUC0402  [C0402]
C3_Y1L  100nF  C-EUC0402  [C0402]
C3_Y2L  100nF  C-EUC0402  [C0402]
C3_ZL  100nF  C-EUC0402  [C0402]
D3  YELLOW  LEDCHIP-LED0603  [CHIP-LED0603]
D4  YELLOW  LEDCHIP-LED0603  [CHIP-LED0603]
D5  YELLOW  LEDCHIP-LED0603  [CHIP-LED0603]
D6  YELLOW  LEDCHIP-LED0603  [CHIP-LED0603]
D7  YELLOW  LEDCHIP-LED0603  [CHIP-LED0603]
D8  YELLOW  LEDCHIP-LED0603  [CHIP-LED0603]
D9  YELLOW  LEDCHIP-LED0603  [CHIP-LED0603]
D39  YELLOW  LEDCHIP-LED0603  [CHIP-LED0603]
J2  Phoenix Pluggable 3.81mm 3 way  CONNECTOR-M3  [3.81MM-3WAY-PLUGGABLE-SCREW]
J3  Phoenix Pluggable 3.81mm 2 way  MC1.5/2  [MC1.5/2-G-3.81]
J4  B4B-XH-A(LF)(SN)  [JST_B4B-XH-A(LF)(SN)]
J5  B4B-XH-A(LF)(SN)  [JST_B4B-XH-A(LF)(SN)]
J6  B4B-XH-A(LF)(SN)  [JST_B4B-XH-A(LF)(SN)]
J7  B4B-XH-A(LF)(SN)  [JST_B4B-XH-A(LF)(SN)]
J8  B4B-XH-A(LF)(SN)  [JST_B4B-XH-A(LF)(SN)]
J15  B4B-XH-A(LF)(SN)  [JST_B4B-XH-A(LF)(SN)]
P17  DB2EVC-3.81-7P-GN  1803471  [PHOENIX_1803471]
R9  0R  R-EU_R0603  [R0603]
R10  DNI  R-EU_R0603  [R0603]
R11  1K  R-EU_R0402  [R0402]
R12  1K  R-EU_R0402  [R0402]
R13  1K  R-EU_R0402  [R0402]
R14  1K  R-EU_R0402  [R0402]
R15  1K  R-EU_R0402  [R0402]
R16  1K  R-EU_R0402  [R0402]
R17  1K  R-EU_R0402  [R0402]
R22_AL  4K7  R-EU_R0402  [R0402]
R22_DR  4K7  R-EU_R0402  [R0402]
R22_PRB  4K7  R-EU_R0402  [R0402]
R22_TLO  4K7  R-EU_R0402  [R0402]
R22_XL  4K7  R-EU_R0402  [R0402]
R22_Y1L  4K7  R-EU_R0402  [R0402]
R22_Y2L  4K7  R-EU_R0402  [R0402]
R22_ZL  4K7  R-EU_R0402  [R0402]
R23_AL  1K  R-EU_R0603  [R0603]
R23_DR  1K  R-EU_R0603  [R0603]
R23_PRB  1K  R-EU_R0603  [R0603]
R23_TLO  1K  R-EU_R0603  [R0603]
R23_XL  1K  R-EU_R0603  [R0603]
R23_Y1L  1K  R-EU_R0603  [R0603]
R23_Y2L  1K  R-EU_R0603  [R0603]
R23_ZL  1K  R-EU_R0603  [R0603]
R63  1K  R-EU_R0402  [R0402]
U2_AL  EL357N-G  [OPTO_EL357N-G]
U2_DR  EL357N-G  [OPTO_EL357N-G]
U2_PRB  EL357N-G  [OPTO_EL357N-G]
U2_TLO  EL357N-G  [OPTO_EL357N-G]
U2_XL  EL357N-G  [OPTO_EL357N-G]
U2_Y1L  EL357N-G  [OPTO_EL357N-G]
U2_Y2L  EL357N-G  [OPTO_EL357N-G]
U2_ZL  EL357N-G  [OPTO_EL357N-G]

### Nets
A_LIM: C3_AL.1 R17.2 R22_AL.2 U2_AL.4(CT) ; also sheet 3
A_LIM_EXT: J8.1 P17.02 U2_AL.2(C)
DOOR: C3_DR.1 R22_DR.2 R63.2 U2_DR.4(CT) ; also sheet 1,3
DOOR_EXT: J15.1 U2_DR.2(C) ; also sheet 6
GND: C3_AL.2 C3_DR.2 C3_PRB.2 C3_TLO.2 C3_XL.2 C3_Y1L.2 C3_Y2L.2 C3_ZL.2 J2.1 J3.1 J4.3 J5.3 J6.3 J7.3 J8.3 J15.3 P17.01 U2_AL.3(ET) U2_DR.3(ET) U2_PRB.3(ET) U2_TLO.3(ET) U2_XL.3(ET) U2_Y1L.3(ET) U2_Y2L.3(ET) U2_ZL.3(ET) ; also sheet 4,5,6,7,9,10,11,12,14
LIMIT_VCC_SEL: J2.3 J4.4 J5.4 J6.4 J7.4 J8.4 J15.4 P17.07 R9.2 R10.2 R23_AL.2 R23_DR.2 R23_PRB.2 R23_TLO.2 R23_XL.2 R23_Y1L.2 R23_Y2L.2 R23_ZL.2
N$102: R23_TLO.1 U2_TLO.1(A)
N$103: D3.C R11.1
N$104: R23_PRB.1 U2_PRB.1(A)
N$105: D4.C R12.1
N$106: R23_XL.1 U2_XL.1(A)
N$107: D5.C R13.1
N$108: R23_Y1L.1 U2_Y1L.1(A)
N$109: D6.C R14.1
N$110: R23_Y2L.1 U2_Y2L.1(A)
N$111: D7.C R15.1
N$112: R23_ZL.1 U2_ZL.1(A)
N$113: D8.C R16.1
N$114: R23_AL.1 U2_AL.1(A)
N$115: D9.C R17.1
N$116: R23_DR.1 U2_DR.1(A)
N$117: D39.C R63.1
PROBE: C3_PRB.1 R12.2 R22_PRB.2 U2_PRB.4(CT) ; also sheet 3
PROBE2: C3_TLO.1 R11.2 R22_TLO.2 U2_TLO.4(CT) ; also sheet 3
PROBE_EXT: J3.2 U2_PRB.2(C)
PROBE_TLO_EXT: J2.2 U2_TLO.2(C)
VCC_MCU_3V3: D3.A D4.A D5.A D6.A D7.A D8.A D9.A D39.A R22_AL.1 R22_DR.1 R22_PRB.1 R22_TLO.1 R22_XL.1 R22_Y1L.1 R22_Y2L.1 R22_ZL.1 ; also sheet 2,3,4,5,6,7,9,11,12,14
VCC_SYS_5V0: R9.1 ; also sheet 5,6,7,9,10,11,14
VCC_SYS_24V0: R10.1 ; also sheet 6,9,10
X_LIM: C3_XL.1 R13.2 R22_XL.2 U2_XL.4(CT) ; also sheet 3
X_LIM_EXT: J4.1 P17.06 U2_XL.2(C)
Y1_LIM: C3_Y1L.1 R14.2 R22_Y1L.2 U2_Y1L.4(CT) ; also sheet 3
Y1_LIM_EXT: J5.1 P17.05 U2_Y1L.2(C)
Y2_LIM: C3_Y2L.1 R15.2 R22_Y2L.2 U2_Y2L.4(CT) ; also sheet 3
Y2_LIM_EXT: J6.1 P17.04 U2_Y2L.2(C)
Z_LIM: C3_ZL.1 R16.2 R22_ZL.2 U2_ZL.4(CT) ; also sheet 3
Z_LIM_EXT: J7.1 P17.03 U2_ZL.2(C)
Unconnected: J4.2 J5.2 J6.2 J7.2 J8.2 J15.2

### Notes on the sheet
- Equiv to Page 18/27 of Longboard_32bit_ext_Schematic_B9_FULL_PLACE.PDF
  
  Includes Page 17/27's Coupler 12v Inputs
- LIMIT SWITCHES

## Sheet 9 of 14: Equiv to Page 19/20/21 of 27 of Longboard_32bit_ext_Schematic_B9_FULL_PLACE.PDF
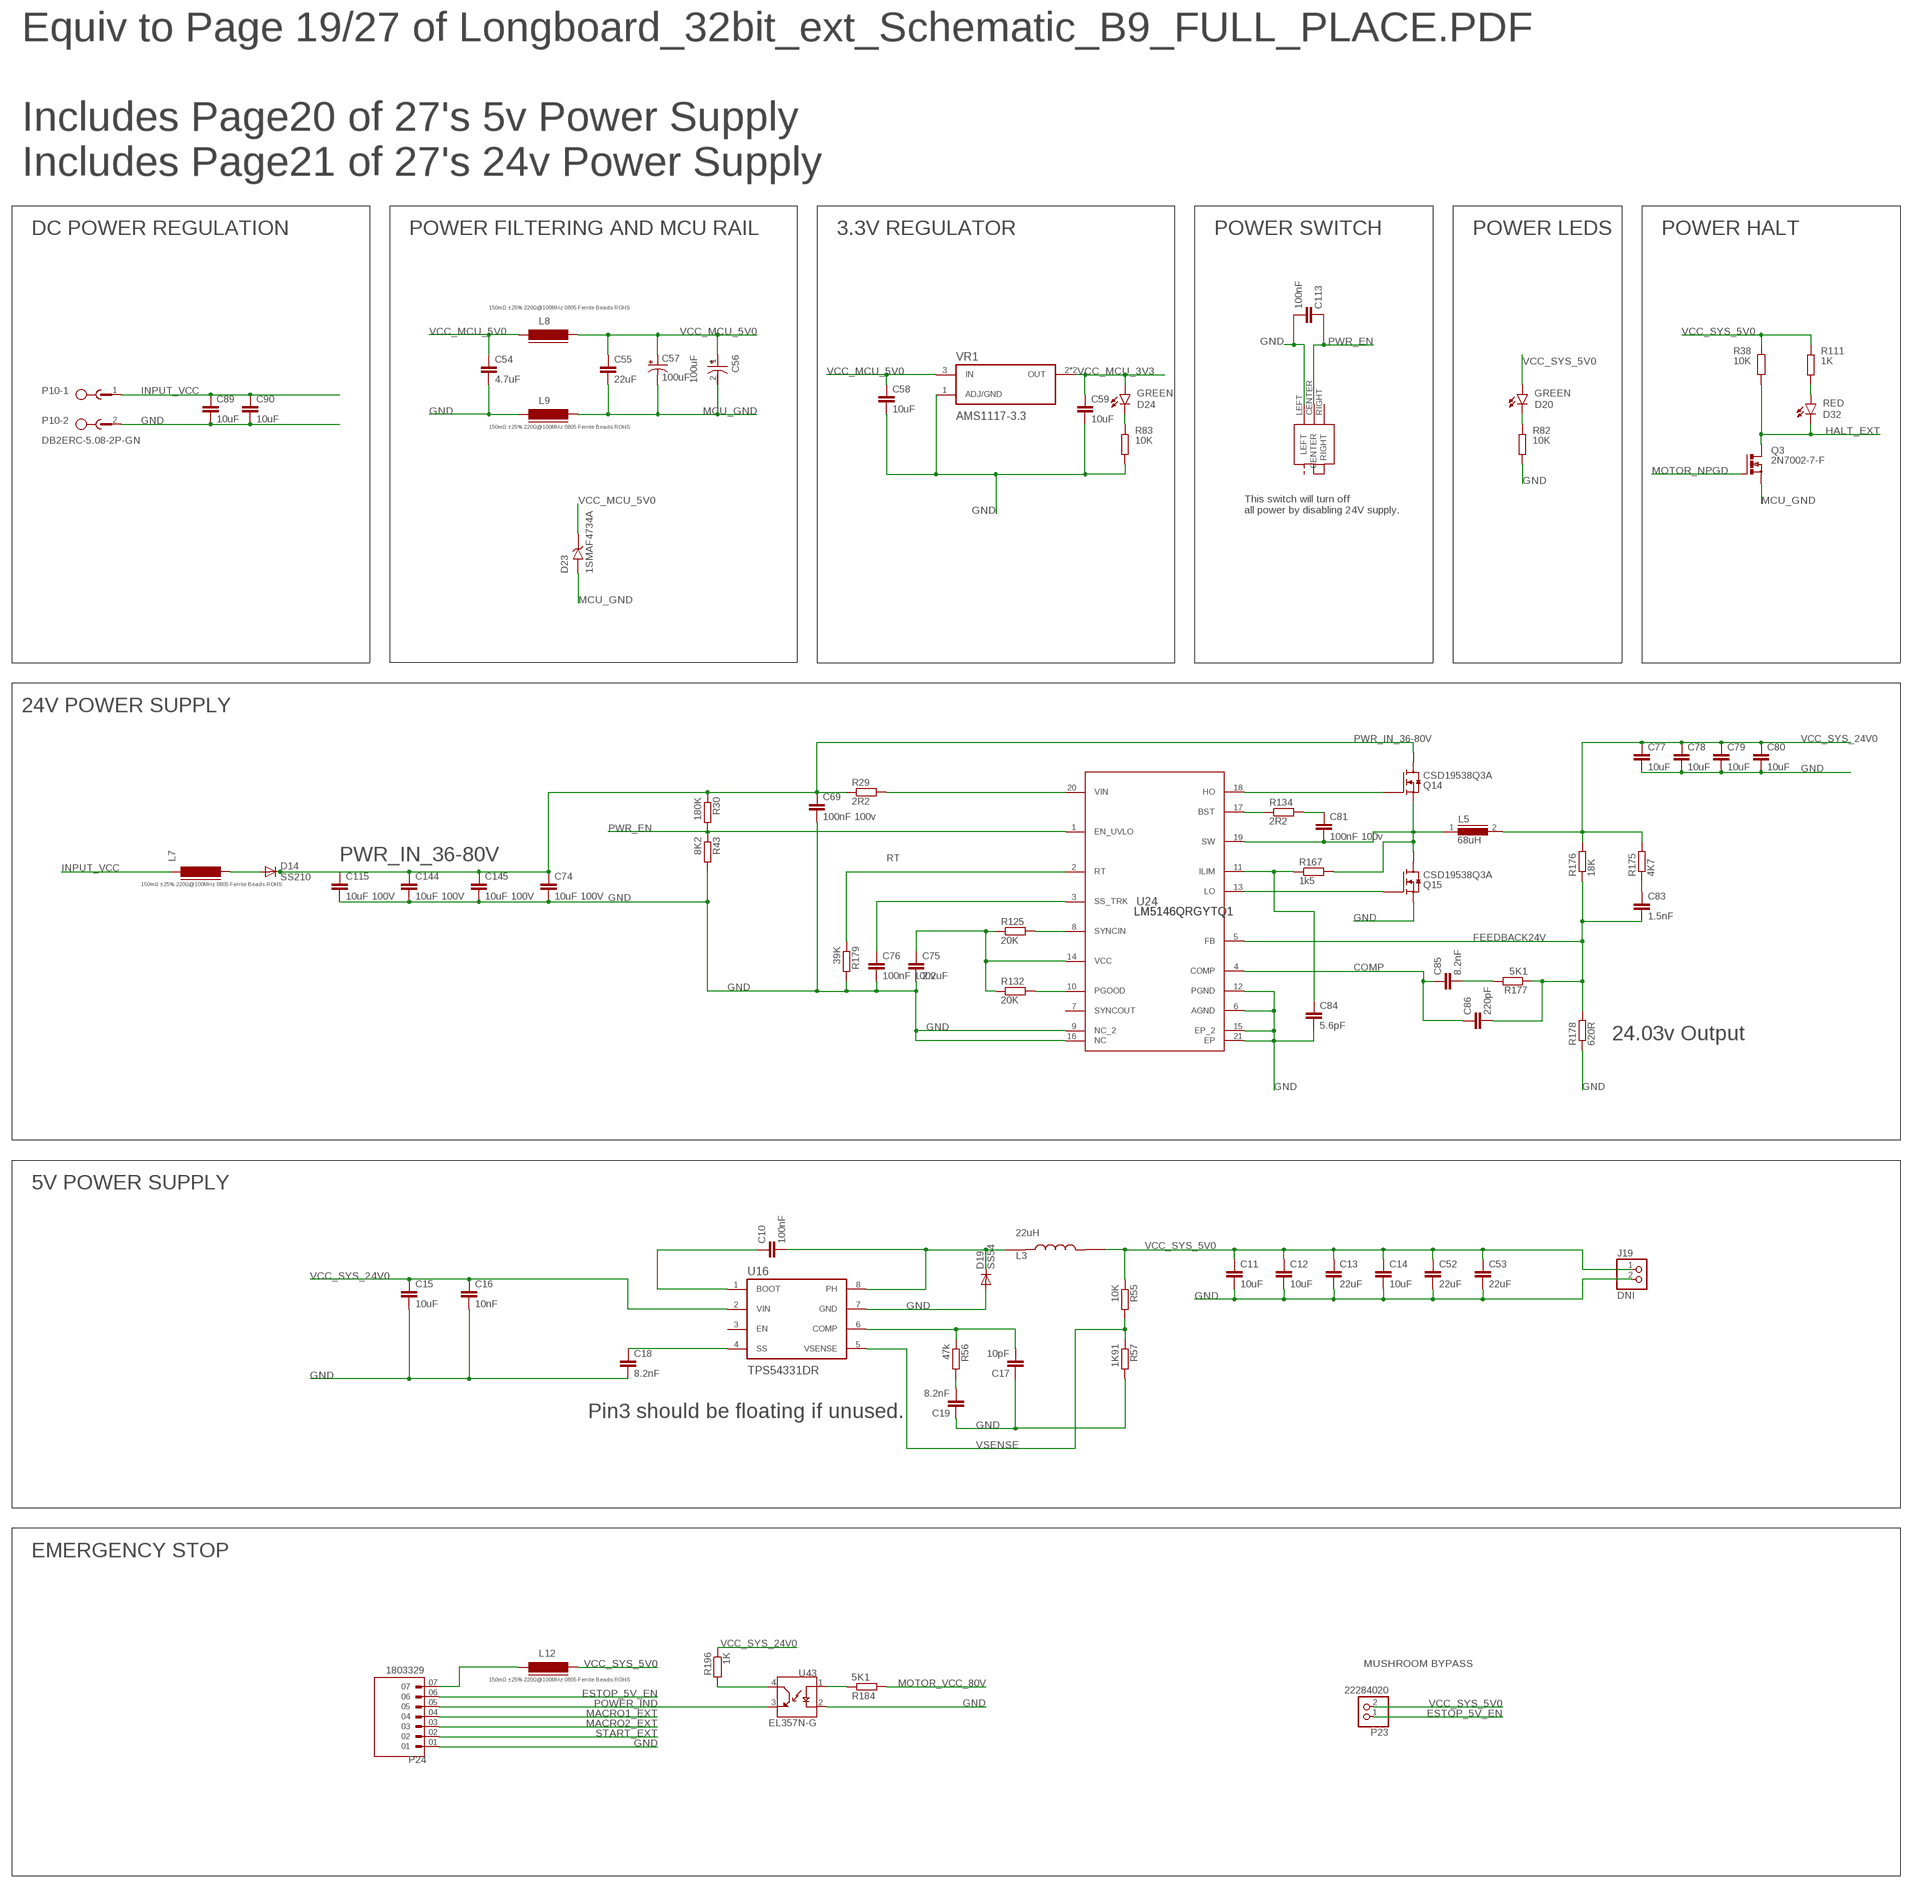
[diagram p10: schematic, sheet 9]

### Parts
C10  100nF  C-EUC0402  [C0402]
C11  10uF  C-EUC1206  [C1206]
C12  10uF  C-EUC1206  [C1206]
C13  22uF  C-EUC0805  [C0805]
C14  10uF  C-EUC1206  [C1206]
C15  10uF  C-EUC1206  [C1206]
C16  10nF  C-EUC0402  [C0402]
C17  10pF  C-EUC0603  [C0603]
C18  8.2nF  C-EUC0603  [C0603]
C19  8.2nF  C-EUC0603  [C0603]
C52  22uF  C-EUC0805  [C0805]
C53  22uF  C-EUC0805  [C0805]
C54  4.7uF  C-EUC0603  [C0603]
C55  22uF  C-EUC0603  [C0603]
C56  100uF  C-3528  [CAPMP3528X210N]
C57  100uF  CPOL-USSANYO_SMD_C6  [SANYO-OSCON_SMD_C6]
C58  10uF  C-EUC1206  [C1206]
C59  10uF  C-EUC1206  [C1206]
C69  100nF 100v  C-EUC0805  [C0805]
C74  10uF 100V  C-EUC0603  [C0603]
C75  2.2uF  C-EUC1206  [C1206]
C76  100nF 100v  C-EUC0805  [C0805]
C77  10uF  C-EUC1206  [C1206]
C78  10uF  C-EUC1206  [C1206]
C79  10uF  C-EUC1206  [C1206]
C80  10uF  C-EUC1206  [C1206]
C81  100nF 100v  C-EUC0603  [C0603]
C83  1.5nF  C-EUC0603  [C0603]
C84  5.6pF  C-EUC0402  [C0402]
C85  8.2nF  C-EUC0603  [C0603]
C86  220pF  C-EUC0603  [C0603]
C89  10uF  C-EUC1206  [C1206]
C90  10uF  C-EUC1206  [C1206]
C113  100nF  C-EUC0603  [C0603]
C115  10uF 100V  C-EUC1210  [C1210]
C144  10uF 100V  C-EUC0805  [C0805]
C145  10uF 100V  C-EUC0805  [C0805]
D14  SS210  DIODE-DO-214AC  [DO-214AC]
D19  SS54  DIODE-DO-214AC  [DO-214AC]
D20  GREEN  LEDCHIP-LED0603  [CHIP-LED0603]
D23  1SMAF4734A  SMAF-ZDIODE  [SMAF-ZDIODE]
D24  GREEN  LEDCHIP-LED0603  [CHIP-LED0603]
D32  RED  LEDCHIP-LED0805  [CHIP-LED0805]
J19  DNI  PINHD-1X2  [1X02]
L3  22uH  YSPI0630A-220M  [YSPI0630A-220M]
L5  68uH  DR125  [DR125]
L7  150mΩ ±25% 220Ω@100MHz 0805 Ferrite Beads ROHS  FERRITE-0402  [FB402]
L8  150mΩ ±25% 220Ω@100MHz 0805 Ferrite Beads ROHS  FERRITE-0805  [FB805]
L9  150mΩ ±25% 220Ω@100MHz 0805 Ferrite Beads ROHS  FERRITE-0805  [FB805]
L12  150mΩ ±25% 220Ω@100MHz 0805 Ferrite Beads ROHS  FERRITE-0805  [FB805]
P10  DB2ERC-5.08-2P-GN  MSTBA2  [MSTBA2]
P23  22284020  PINHD-1X2  [1X02]
P24  1803329  [PHOENIX_1803329]
Q3  2N7002-7-F  [SOT-23]
Q14  CSD19538Q3A  [CSD19538Q3A]
Q15  CSD19538Q3A  [CSD19538Q3A]
R29  2R2  R-EU_R0603  [R0603]
R30  180K  R-EU_R0603  [R0603]
R38  10K  R-EU_R0603  [R0603]
R43  8K2  R-EU_R0603  [R0603]
R55  10K  R-EU_R0603  [R0603]
R56  47k  R-EU_R0603  [R0603]
R57  1K91  R-EU_R0603  [R0603]
R82  10K  R-EU_R0603  [R0603]
R83  10K  R-EU_R0603  [R0603]
R111  1K  R-EU_R0603  [R0603]
R125  20K  R-EU_R0603  [R0603]
R132  20K  R-EU_R0603  [R0603]
R134  2R2  R-EU_R0603  [R0603]
R167  1k5  R-EU_R0603  [R0603]
R175  4K7  R-EU_R0603  [R0603]
R176  18K  R-EU_R0603  [R0603]
R177  5K1  R-EU_R0603  [R0603]
R178  620R  R-EU_R0603  [R0603]
R179  39K  R-EU_R0603  [R0603]
R184  5K1  R-EU_R0603  [R0603]
R196  1K  R-EU_R0603  [R0603]
S1  SS-12D11G5R  XKBENTERPRISESS-12D11G5R  [XKBENTERPRISESS-12D11G5R]
U16  TPS54331DR  [SOIC127P599X175-8N]
U24  LM5146QRGYTQ1  [RGY0020B]
U43  EL357N-G  [OPTO_EL357N-G]
VR1  AMS1117-3.3  [AMS1117-3.3]

### Nets
COMP: C85.1 C86.1 U24.4(COMP)
ESTOP_5V_EN: P23.1 P24.06
FEEDBACK24V: C83.2 C86.2 R176.1 R177.1 R178.2 U24.5(FB)
GND: C11.2 C12.2 C13.2 C14.2 C15.2 C16.2 C17.1 C18.2 C19.1 C52.2 C53.2 C54.2 C58.2 C59.2 C69.2 C74.2 C75.2 C76.2 C77.2 C78.2 C79.2 C80.2 C84.2 C89.2 C90.2 C113.2 C115.2 C144.2 C145.2 D19.2(A) J19.2 L9.1 P10.2 P24.01 Q15.1(SOURCE) Q15.2(SOURCE) Q15.3(SOURCE) R43.2 R57.2 R82.2 R83.2 R178.1 R179.2 S1.LEFT U16.7(GND) U24.6(AGND) U24.9(NC_2) U24.12(PGND) U24.15(EP_2) U24.16(NC) U24.21(EP) U43.2(C) VR1.1(ADJ/GND) ; also sheet 4,5,6,7,8,10,11,12,14
HALT_EXT: D32.C Q3.P3(D) R38.2 ; also sheet 7
INPUT_VCC: C89.1 C90.1 L7.1 P10.1 ; also sheet 10
MACRO1_EXT: P24.04 ; also sheet 7
MACRO2_EXT: P24.03 ; also sheet 7
MCU_GND: C55.2 C56.2 C57.- D23.A L9.2 Q3.P2(S) ; also sheet 2,3,5,6,11,12,13,14
MOTOR_NPGD: Q3.P1(G) ; also sheet 10
MOTOR_VCC_80V: R184.2 ; also sheet 5,10
N$118: D14.2(A) L7.2
N$119: C10.2 D19.1(C) L3.1 U16.8(PH)
N$120: R29.2 U24.20(VIN)
N$121: C76.1 U24.3(SS_TRK)
N$122: R125.2 U24.8(SYNCIN)
N$123: R132.2 U24.10(PGOOD)
N$124: C75.1 R125.1 R132.1 U24.14(VCC)
N$125: Q14.4(GATE) U24.18(HO)
N$126: C85.2 R177.2
N$127: Q15.4(GATE) U24.13(LO)
N$128: C84.1 R167.1 U24.11(ILIM)
N$129: R134.1 U24.17(BST)
N$130: C81.1 R134.2
N$131: C81.2 L5.1 Q14.1(SOURCE) Q14.2(SOURCE) Q14.3(SOURCE) Q15.5(DRAIN) Q15.6(DRAIN) Q15.7(DRAIN) Q15.8(DRAIN) Q15.9(DRAIN) Q15.10(DRAIN) Q15.11(DRAIN) Q15.12(DRAIN) R167.2 U24.19(SW)
N$132: C83.1 R175.1
N$133: C18.1 U16.4(SS)
N$134: C10.1 U16.1(BOOT)
N$135: C19.2 R56.2
N$136: D24.C R83.1
N$137: C17.2 R56.1 U16.6(COMP)
N$138: D20.C R82.1
N$139: L12.1 P24.07
N$140: D32.A R111.2
N$141: R184.1 U43.1(A)
N$142: R196.2 U43.4(CT)
POWER_IND: P24.05 U43.3(ET)
PWR_EN: C113.1 R30.2 R43.1 S1.CENTER U24.1(EN_UVLO)
PWR_IN_36-80V: C69.1 C74.1 C115.1 C144.1 C145.1 D14.1(C) Q14.5(DRAIN) Q14.6(DRAIN) Q14.7(DRAIN) Q14.8(DRAIN) Q14.9(DRAIN) Q14.10(DRAIN) Q14.11(DRAIN) Q14.12(DRAIN) R29.1 R30.1
RT: R179.1 U24.2(RT)
START_EXT: P24.02 ; also sheet 7
VCC_MCU_3V3: C59.1 D24.A VR1.2(OUT) VR1.4(OUT) ; also sheet 2,3,4,5,6,7,8,11,12,14
VCC_MCU_5V0: C54.1 C55.1 C56.1 C57.+ C58.1 D23.C L8.1 L8.2 VR1.3(IN) ; also sheet 6,11,12
VCC_SYS_5V0: C11.1 C12.1 C13.1 C14.1 C52.1 C53.1 D20.A J19.1 L3.2 L12.2 P23.2 R38.1 R55.1 R111.1 ; also sheet 5,6,7,8,10,11,14
VCC_SYS_24V0: C15.1 C16.1 C77.1 C78.1 C79.1 C80.1 L5.2 R175.2 R176.2 R196.1 U16.2(VIN) ; also sheet 6,8,10
VSENSE: R55.2 R57.1 U16.5(VSENSE)
Unconnected: S1.RIGHT U16.3(EN) U24.7(SYNCOUT)

### Notes on the sheet
- Equiv to Page 19/27 of Longboard_32bit_ext_Schematic_B9_FULL_PLACE.PDF
  
  Includes Page20 of 27's 5v Power Supply
  Includes Page21 of 27's 24v Power Supply
- DC POWER REGULATION | POWER FILTERING AND MCU RAIL | 3.3V REGULATOR | POWER SWITCH | POWER LEDS | POWER HALT
- This switch will turn off 
  all power by disabling 24V supply.
- 24V POWER SUPPLY
- 24.03v Output
- 5V POWER SUPPLY
- Pin3 should be floating if unused.
- EMERGENCY STOP
- MUSHROOM BYPASS

## Sheet 10 of 14: Equiv to Page 22 of 27 of Longboard_32bit_ext_Schematic_B9_FULL_PLACE.PDF
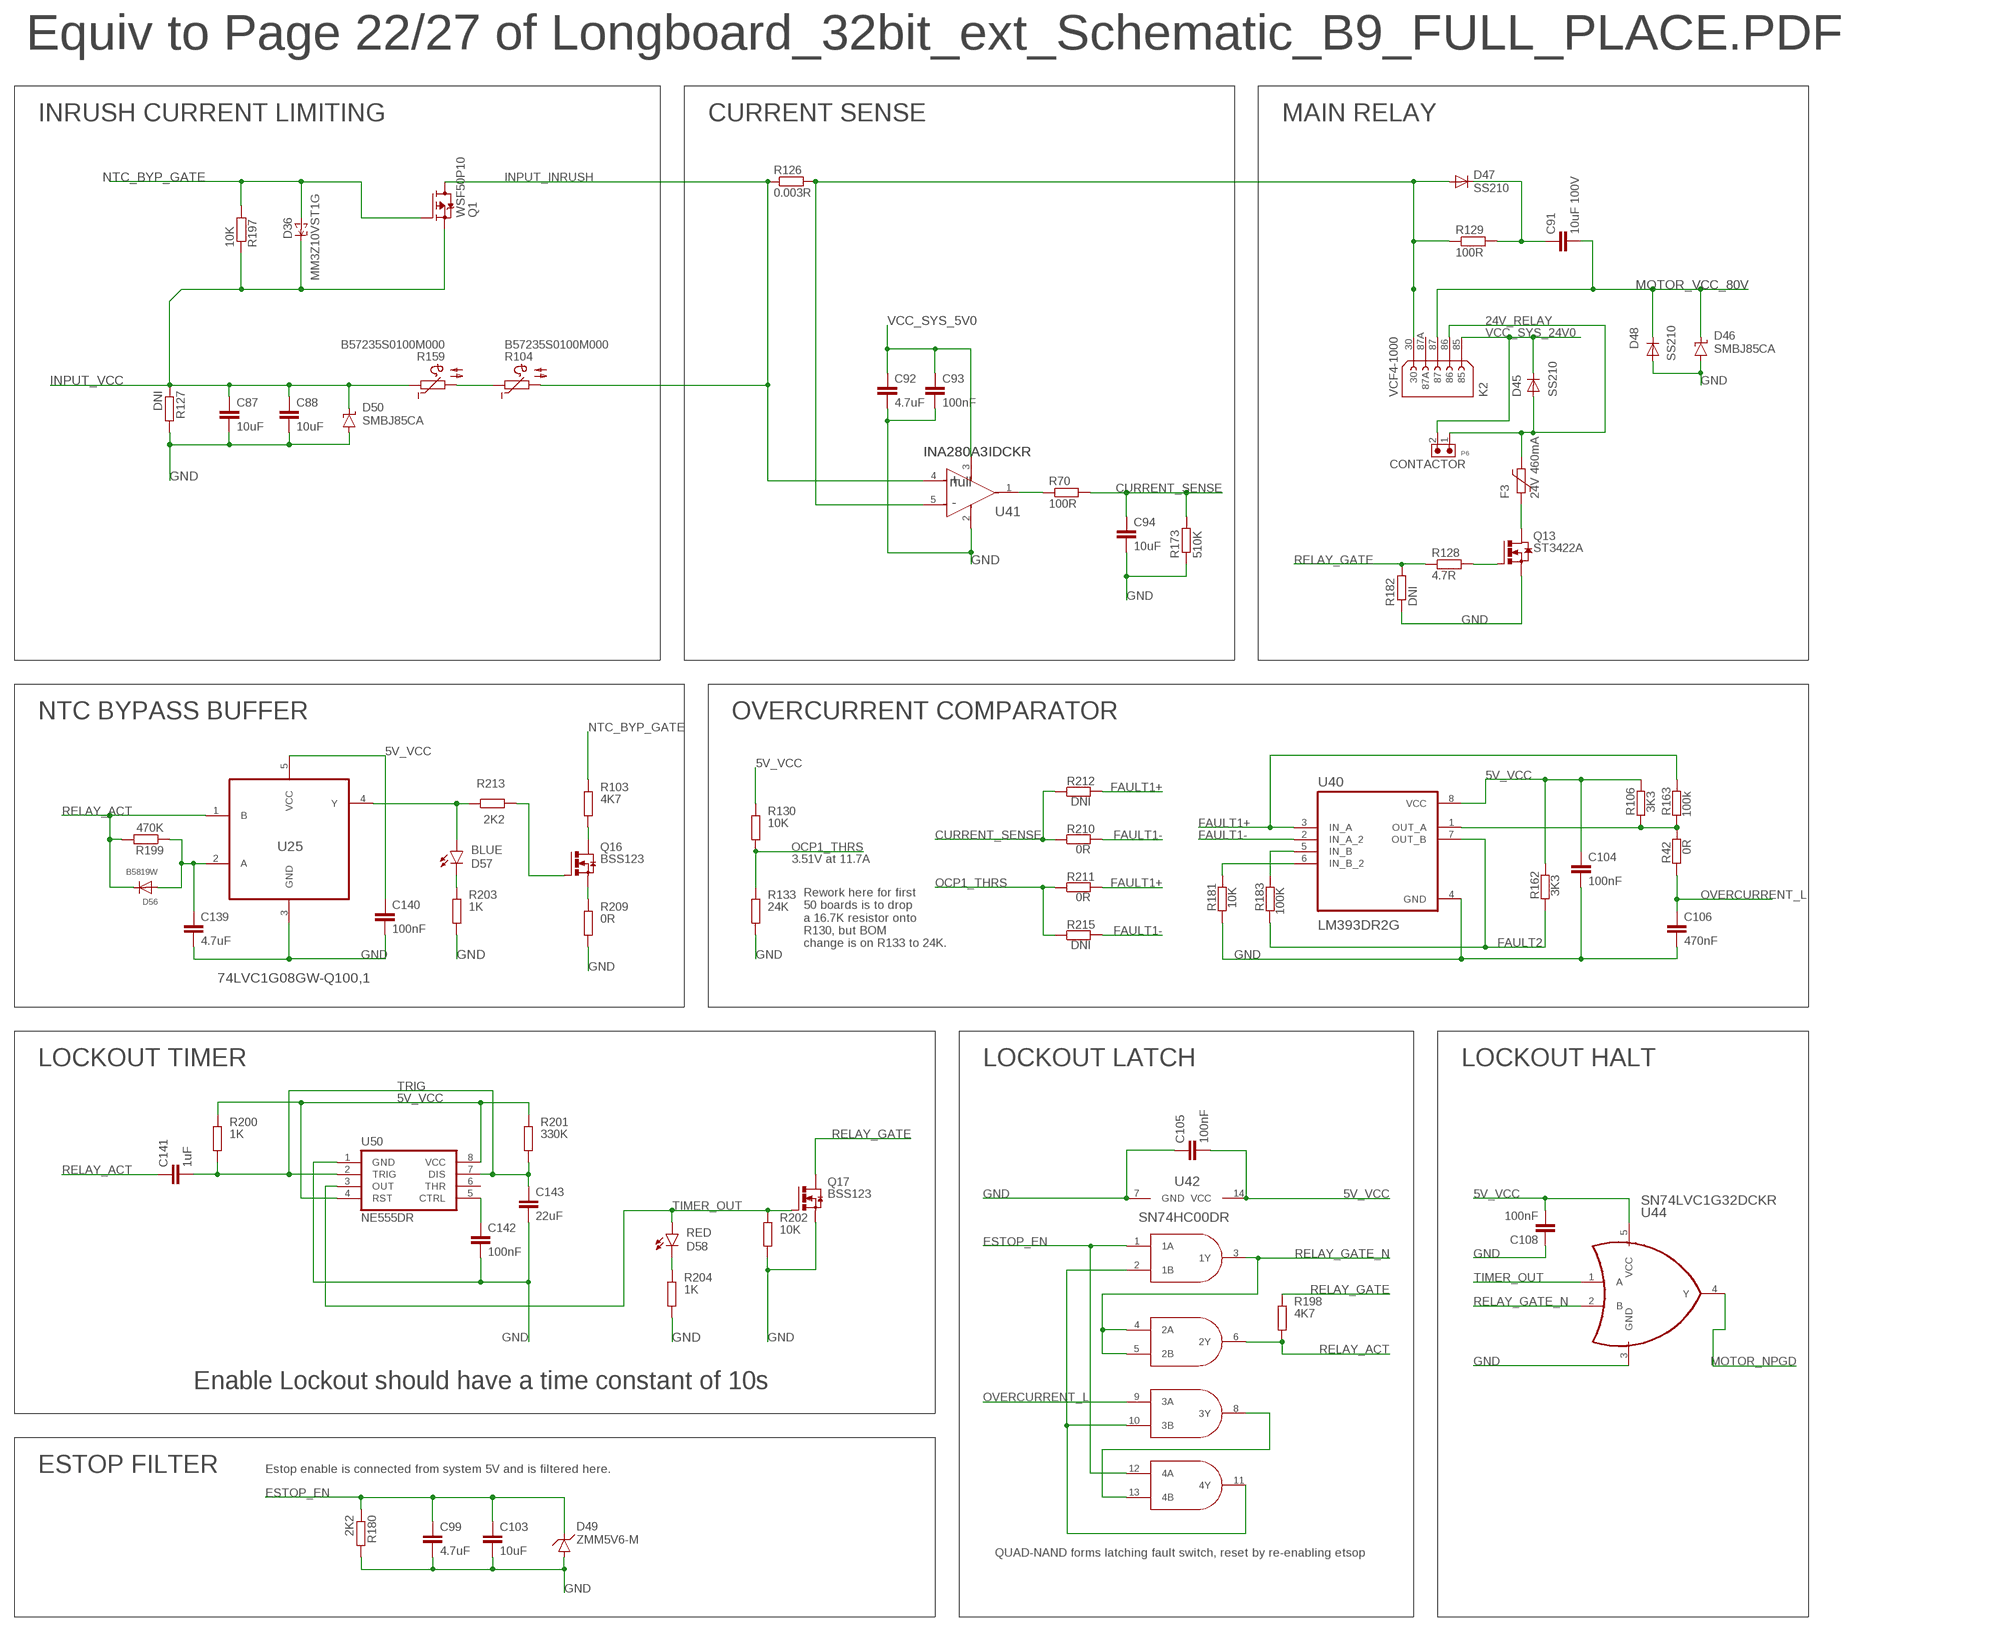
[diagram p11: schematic, sheet 10]

### Parts
C87  10uF  C-EUC1206  [C1206]
C88  10uF  C-EUC1206  [C1206]
C91  10uF 100V  C-EUC1210  [C1210]
C92  4.7uF  C-EUC0603  [C0603]
C93  100nF  C-EUC0603  [C0603]
C94  10uF  C-EUC0603  [C0603]
C99  4.7uF  C-EUC0805  [C0805]
C103  10uF  C-EUC0805  [C0805]
C104  100nF  C-EUC0603  [C0603]
C105  100nF  C-EUC0603  [C0603]
C106  470nF  C-EUC0603  [C0603]
C108  100nF  C-EUC0603  [C0603]
C139  4.7uF  C-EUC1206  [C1206]
C140  100nF  C-EUC0603  [C0603]
C141  1uF  C-EUC0603  [C0603]
C142  100nF  C-EUC0603  [C0603]
C143  22uF  C-EUC1206  [C1206]
D36  MM3Z10VST1G  ZENERSOD-323F  [SOD-323F]
D45  SS210  DIODE-DO-214AC  [DO-214AC]
D46  SMBJ85CA  SUPPRESSOR-SMBJ  [SMBJ]
D47  SS210  DIODE-DO-214AC  [DO-214AC]
D48  SS210  DIODE-DO-214AC  [DO-214AC]
D49  ZMM5V6-M  DIODE-MINIMELF  [MINIMELF]
D50  SMBJ85CA  SUPPRESSOR-SMBJ  [SMBJ]
D56  B5819W  [SOD123FL]
D57  BLUE  LEDCHIP-LED0603  [CHIP-LED0603]
D58  RED  LEDCHIP-LED0603  [CHIP-LED0603]
F3  24V 460mA  1206L050  [1206L]
K2  VCF4-1000  [TE_VCF4-1000]
P6  WJ15EDGK-3.81-2P  DB2EVC-3.81-2P-GN  [DB2EVC-3.81-2P-GN]
Q1  WSF50P10  FDD4141TO252  [TO252]
Q13  ST3422A  [SOT-23]
Q16  BSS123  BSS123TA  [SOT95P240X110-3N]
Q17  BSS123  BSS123TA  [SOT95P240X110-3N]
R42  0R  R-EU_R0603  [R0603]
R70  100R  R-EU_R0603  [R0603]
R103  4K7  R-EU_R0603  [R0603]
R104  B57235S0100M000  B57164  [B57164]
R106  3K3  R-EU_R0603  [R0603]
R126  0.003R  R-EU_R1206  [R1206]
R127  DNI  R-EU_R0603  [R0603]
R128  4.7R  R-EU_R0603  [R0603]
R129  100R  R-EU_R1206  [R1206]
R130  10K  R-EU_R0603  [R0603]
R133  24K  R-EU_R0603  [R0603]
R159  B57235S0100M000  B57164  [B57164]
R162  3K3  R-EU_R0603  [R0603]
R163  100k  R-EU_R0603  [R0603]
R173  510K  R-EU_R0603  [R0603]
R180  2K2  R-EU_R0603  [R0603]
R181  10K  R-EU_R0603  [R0603]
R182  DNI  R-EU_R1206  [R1206]
R183  100K  R-EU_R0603  [R0603]
R197  10K  R-EU_R0603  [R0603]
R198  4K7  R-EU_R0603  [R0603]
R199  470K  R-EU_R0603  [R0603]
R200  1K  R-EU_R0603  [R0603]
R201  330K  R-EU_R0603  [R0603]
R202  10K  R-EU_R0603  [R0603]
R203  1K  R-EU_R0603  [R0603]
R204  1K  R-EU_R0603  [R0603]
R209  0R  R-EU_R0603  [R0603]
R210  0R  R-EU_R0603  [R0603]
R211  0R  R-EU_R0603  [R0603]
R212  DNI  R-EU_R0603  [R0603]
R213  2K2  R-EU_R0603  [R0603]
R215  DNI  R-EU_R0603  [R0603]
U25  74LVC1G08GW-Q100,1  [SOT65P210X110-5N]
U40  LM393DR2G  [SOIC127P600X265-8N]
U41  INA280A3IDCKR  [DCK0005A-IPC_A]
U42  SN74HC00DR  [SOIC127P600X175-14N]
U44  SN74LVC1G32DCKR  SN74LVC1G32DCKRE4  [SOT65P210X110-5N]
U50  NE555DR  IC_555-SOIC8  [SOIC-8]

### Nets
5V_VCC: C104.1 C105.2 C108.2 C140.1 R106.2 R130.1 R162.2 R200.1 R201.1 U25.5(VCC) U40.8(VCC) U42.14(VCC) U44.5(VCC) U50.4(RST) U50.8(VCC)
24V_RELAY: D45.2(A) F3.1 K2.86 P6.1
CTRL: C142.1 U50.5(CTRL)
CURRENT_SENSE: C94.1 R70.2 R173.2 R210.1 R212.1
ESTOP_EN: C99.1 C103.1 D49.C R180.1 U42.1(1A) U42.12(4A)
FAULT1+: R163.2 R211.2 R212.2 U40.3(IN_A)
FAULT1-: R210.2 R215.2 U40.2(IN_A_2)
FAULT2: R162.1 R183.1 U40.7(OUT_B)
GND: C87.2 C88.2 C92.2 C93.2 C94.2 C99.2 C103.2 C104.2 C105.1 C106.2 C108.1 C139.2 C140.2 C142.2 C143.2 D46.A D48.2(A) D49.A D50.A Q13.P2(S) Q17.S R127.2 R133.2 R173.1 R180.2 R181.1 R182.1 R202.2 R203.2 R204.2 R209.2 U25.3(GND) U40.4(GND) U41.2(GND) U42.7(GND) U44.3(GND) U50.1(GND) ; also sheet 4,5,6,7,8,9,11,12,14
INPUT_INRUSH: Q1.3(D) R104.2 R126.1 U41.4(IN+)
INPUT_VCC: C87.1 C88.1 D36.C D50.C Q1.2(S) R127.1 R159.1 R197.1 ; also sheet 9
MOTOR_NPGD: U44.4(Y) ; also sheet 9
MOTOR_VCC_80V: C91.2 D46.C D48.1(C) K2.87 ; also sheet 5,9
N$143: R104.1 R159.2
N$144: D47.2(A) K2.30 R126.2 R129.1 U41.5(IN-)
N$145: C91.1 D47.1(C) R129.2
N$146: Q13.P1(G) R128.2
N$147: F3.2 Q13.P3(D)
N$148: R70.1 U41.1(OUT)
N$149: D57.A R213.1 U25.4(Y)
N$150: D57.C R203.1
N$151: C139.1 D56.A R199.1 U25.2(A)
N$152: Q16.D R103.2
N$153: Q16.S R209.1
N$154: Q16.G R213.2
N$155: R181.2 U40.6(IN_B_2)
N$156: R183.2 U40.5(IN_B)
N$157: D58.C R204.1
N$158: R42.2 R106.1 R163.1 U40.1(OUT_A)
N$159: U42.2(1B) U42.10(3B) U42.11(4Y)
N$161: U42.8(3Y) U42.13(4B)
NTC_BYP_GATE: D36.A Q1.1(G) R103.1 R197.2
OCP1_THRS: R130.2 R133.1 R211.1 R215.1
OVERCURRENT_L: C106.1 R42.1 U42.9(3A)
RELAY_ACT: C141.1 D56.C R198.2 R199.2 U25.1(B) U42.6(2Y)
RELAY_GATE: Q17.D R128.1 R182.2 R198.1
RELAY_GATE_N: U42.3(1Y) U42.4(2A) U42.5(2B) U44.2(B)
TIMER_OUT: D58.A Q17.G R202.1 U44.1(A) U50.3(OUT)
TRIG: C141.2 C143.1 R200.2 R201.2 U50.2(TRIG) U50.7(DIS)
VCC_SYS_5V0: C92.1 C93.1 U41.3(VS) ; also sheet 5,6,7,8,9,11,14
VCC_SYS_24V0: D45.1(C) K2.85 P6.2 ; also sheet 6,8,9
Unconnected: K2.87A U50.6(THR)

### Notes on the sheet
- Equiv to Page 22/27 of Longboard_32bit_ext_Schematic_B9_FULL_PLACE.PDF
- INRUSH CURRENT LIMITING | CURRENT SENSE | MAIN RELAY
- CONTACTOR
- NTC BYPASS BUFFER | OVERCURRENT COMPARATOR
- 3.51V at 11.7A
- Rework here for first 
  50 boards is to drop 
  a 16.7K resistor onto 
  R130, but BOM 
  change is on R133 to 24K.
- LOCKOUT TIMER | LOCKOUT LATCH | LOCKOUT HALT
- Enable Lockout should have a time constant of 10s
- ESTOP FILTER | Estop enable is connected from system 5V and is filtered here.
- QUAD-NAND forms latching fault switch, reset by re-enabling etsop